# EasyEDA Pro project ProPrj_ProjetElectronique_ESP32Board_2024-12-16.epro, schematic Schematics

## Sheets
1 Power: Board Name: ESP32Board; Create Date: 2024-11-04; Page Name: Power; Project Name: ProjetElectronique_ESP32Board; Schematic Name: Schematics; Update Date: 2024-11-26; Company: EasyEDA.com; Drawn: EasyEDA; Page Size: A4; Part Number: JLCPCB-002; Reviewed: EasyEDA; Version: V0.1
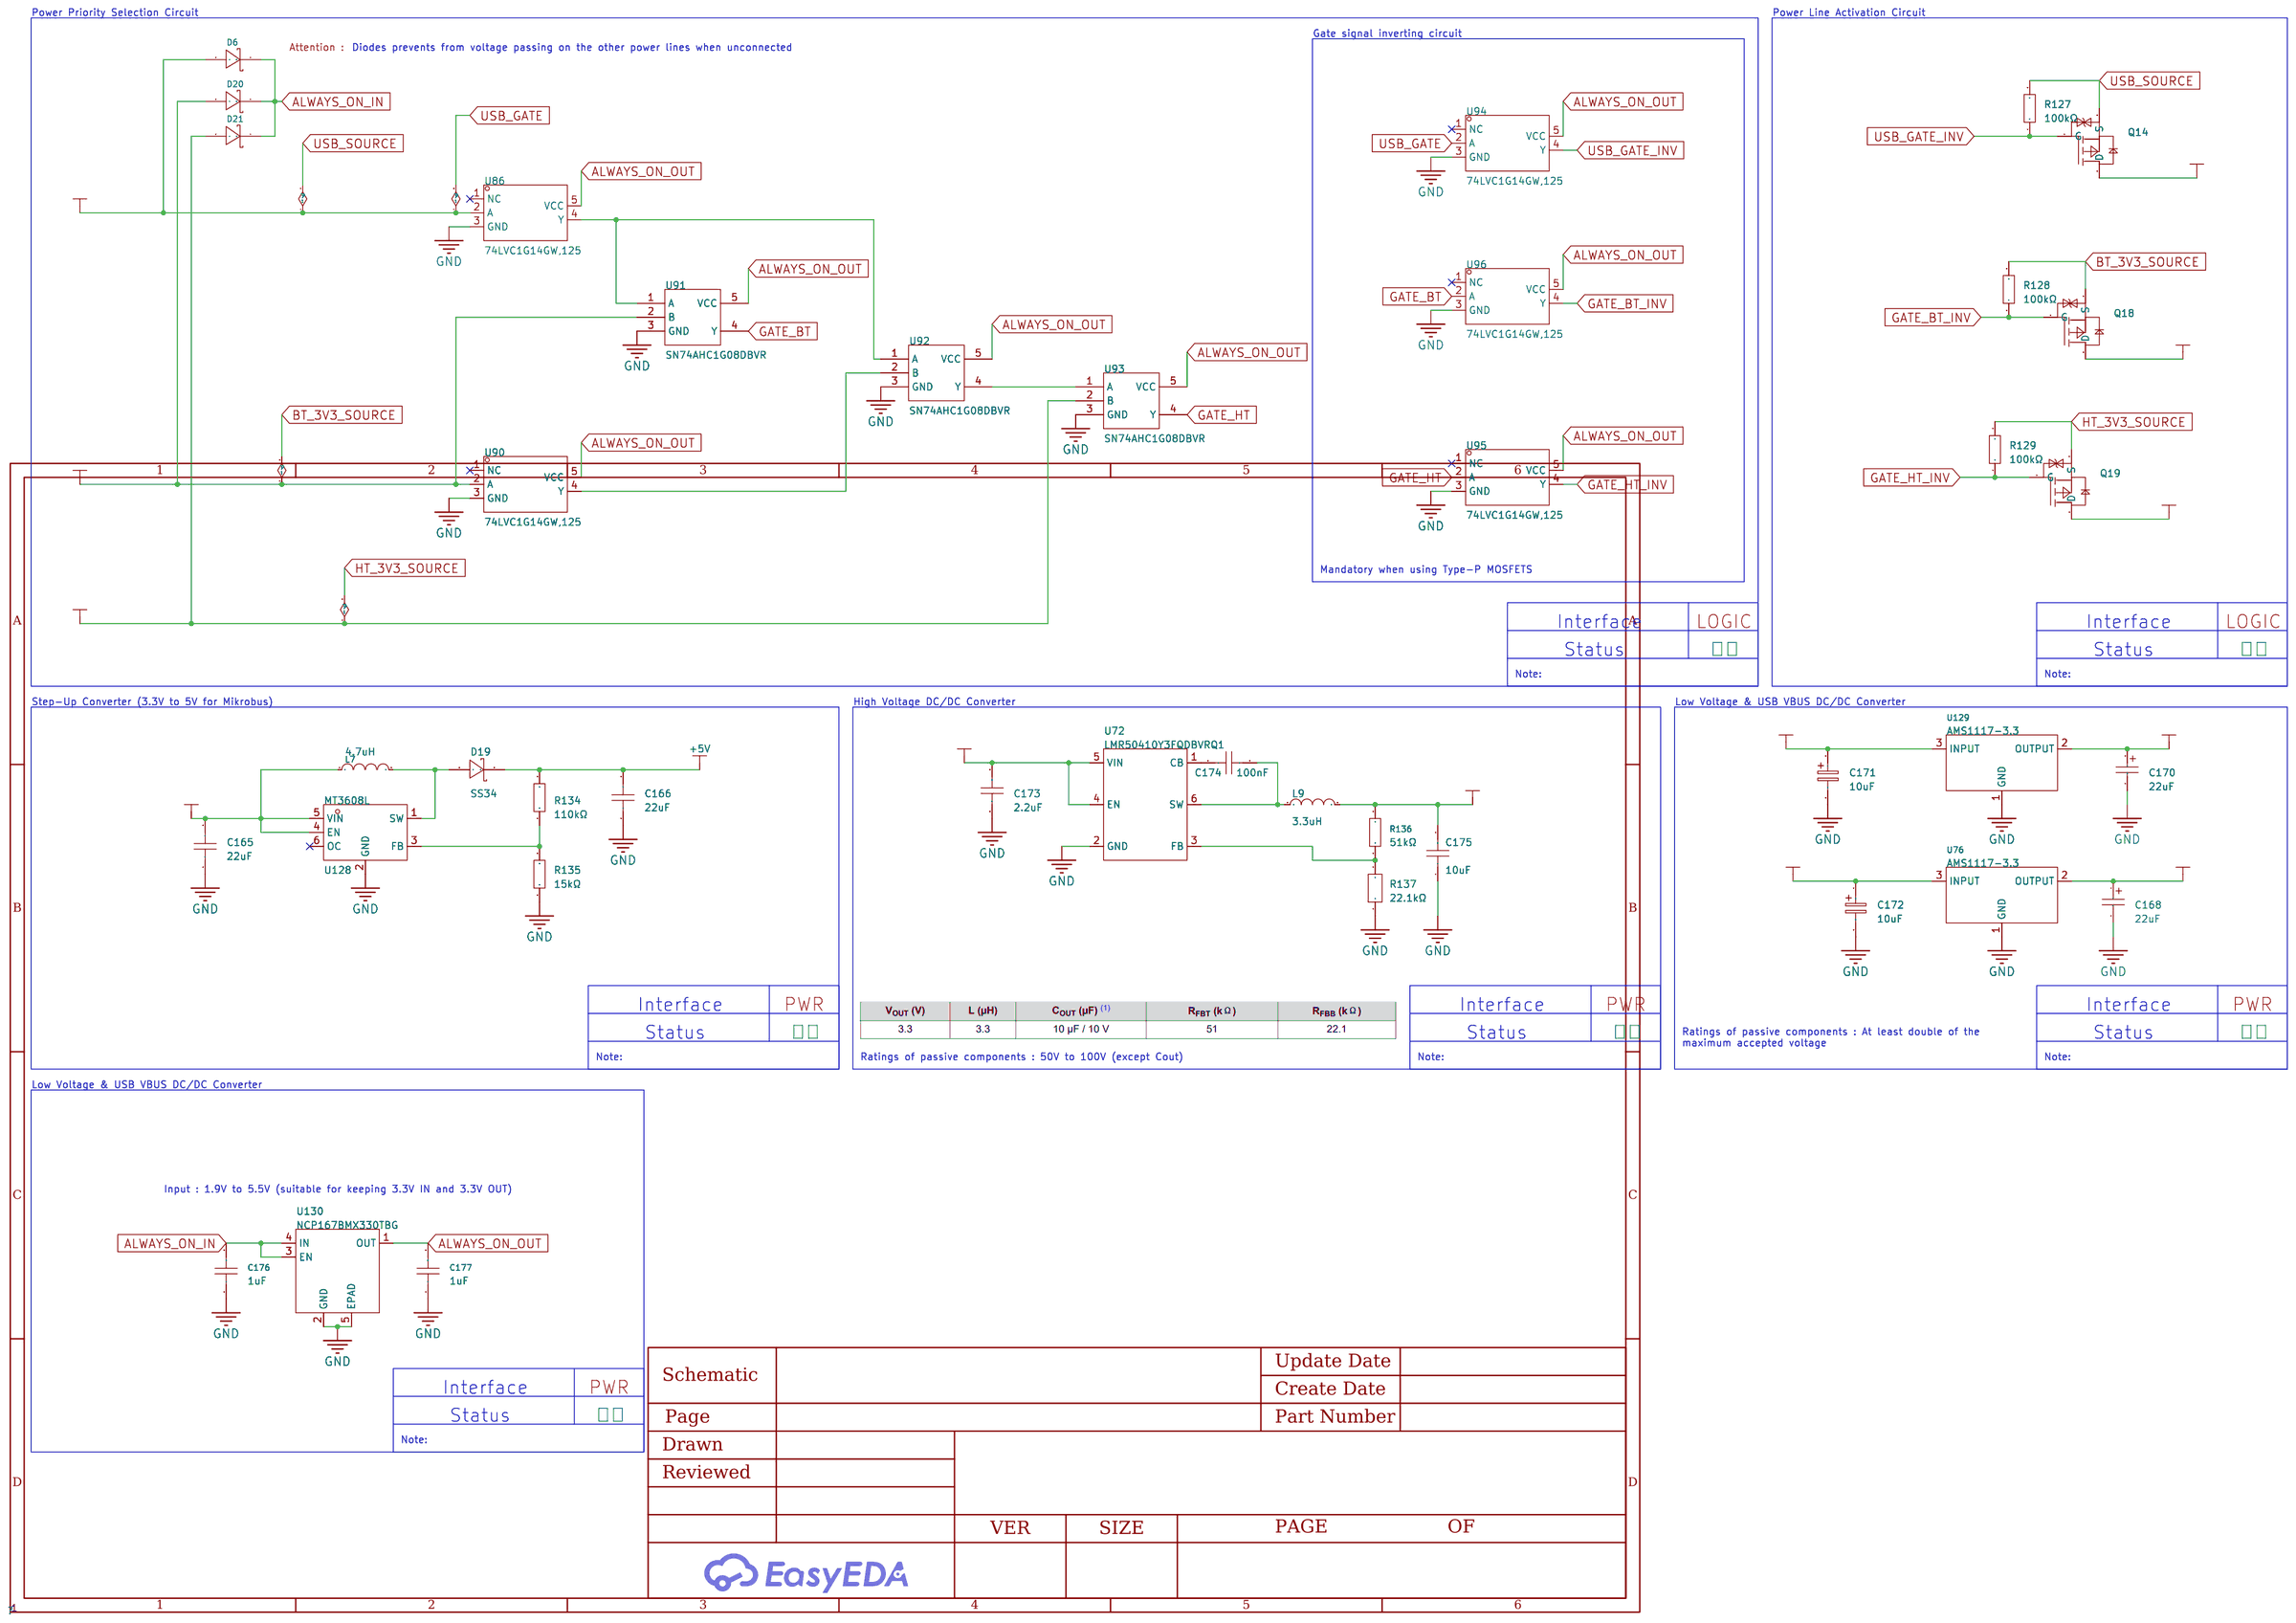
[diagram p0: Power]
2 Microcontroller: Page Name: Microcontroller; Update Date: 2024-12-16
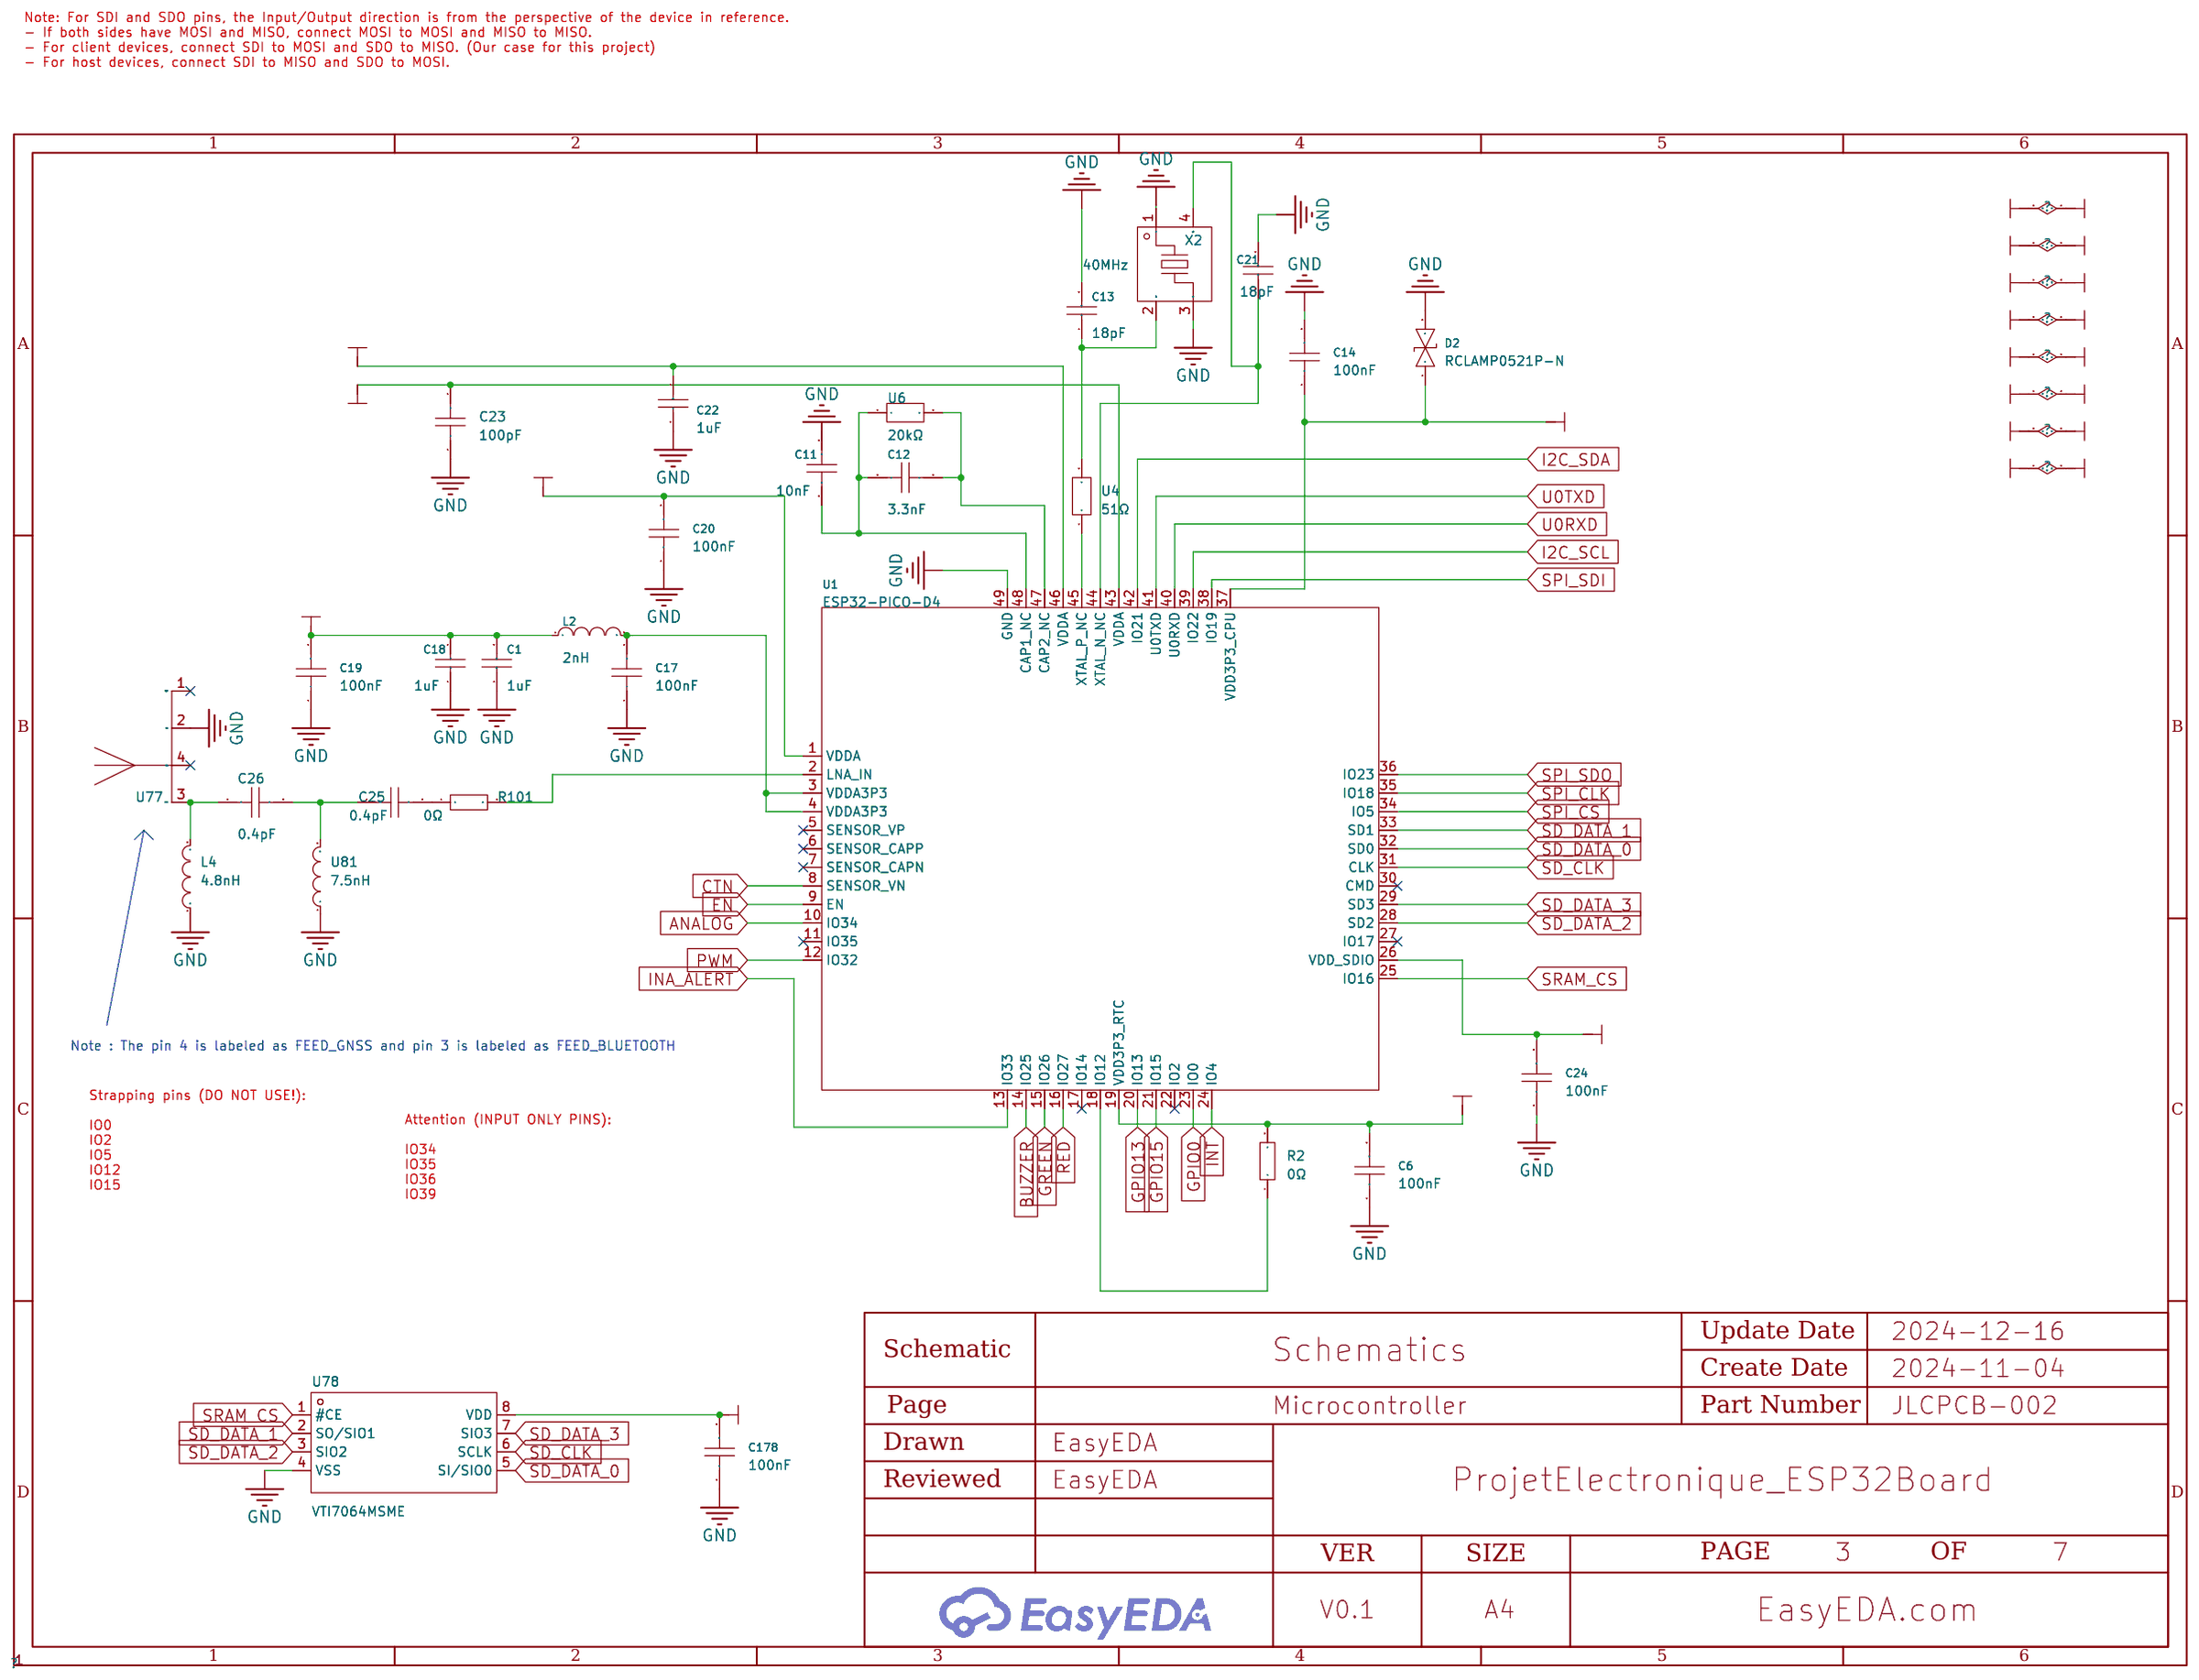
[diagram p1: Microcontroller]
3 Peripherals: Page Name: Peripherals; Update Date: 2024-12-16
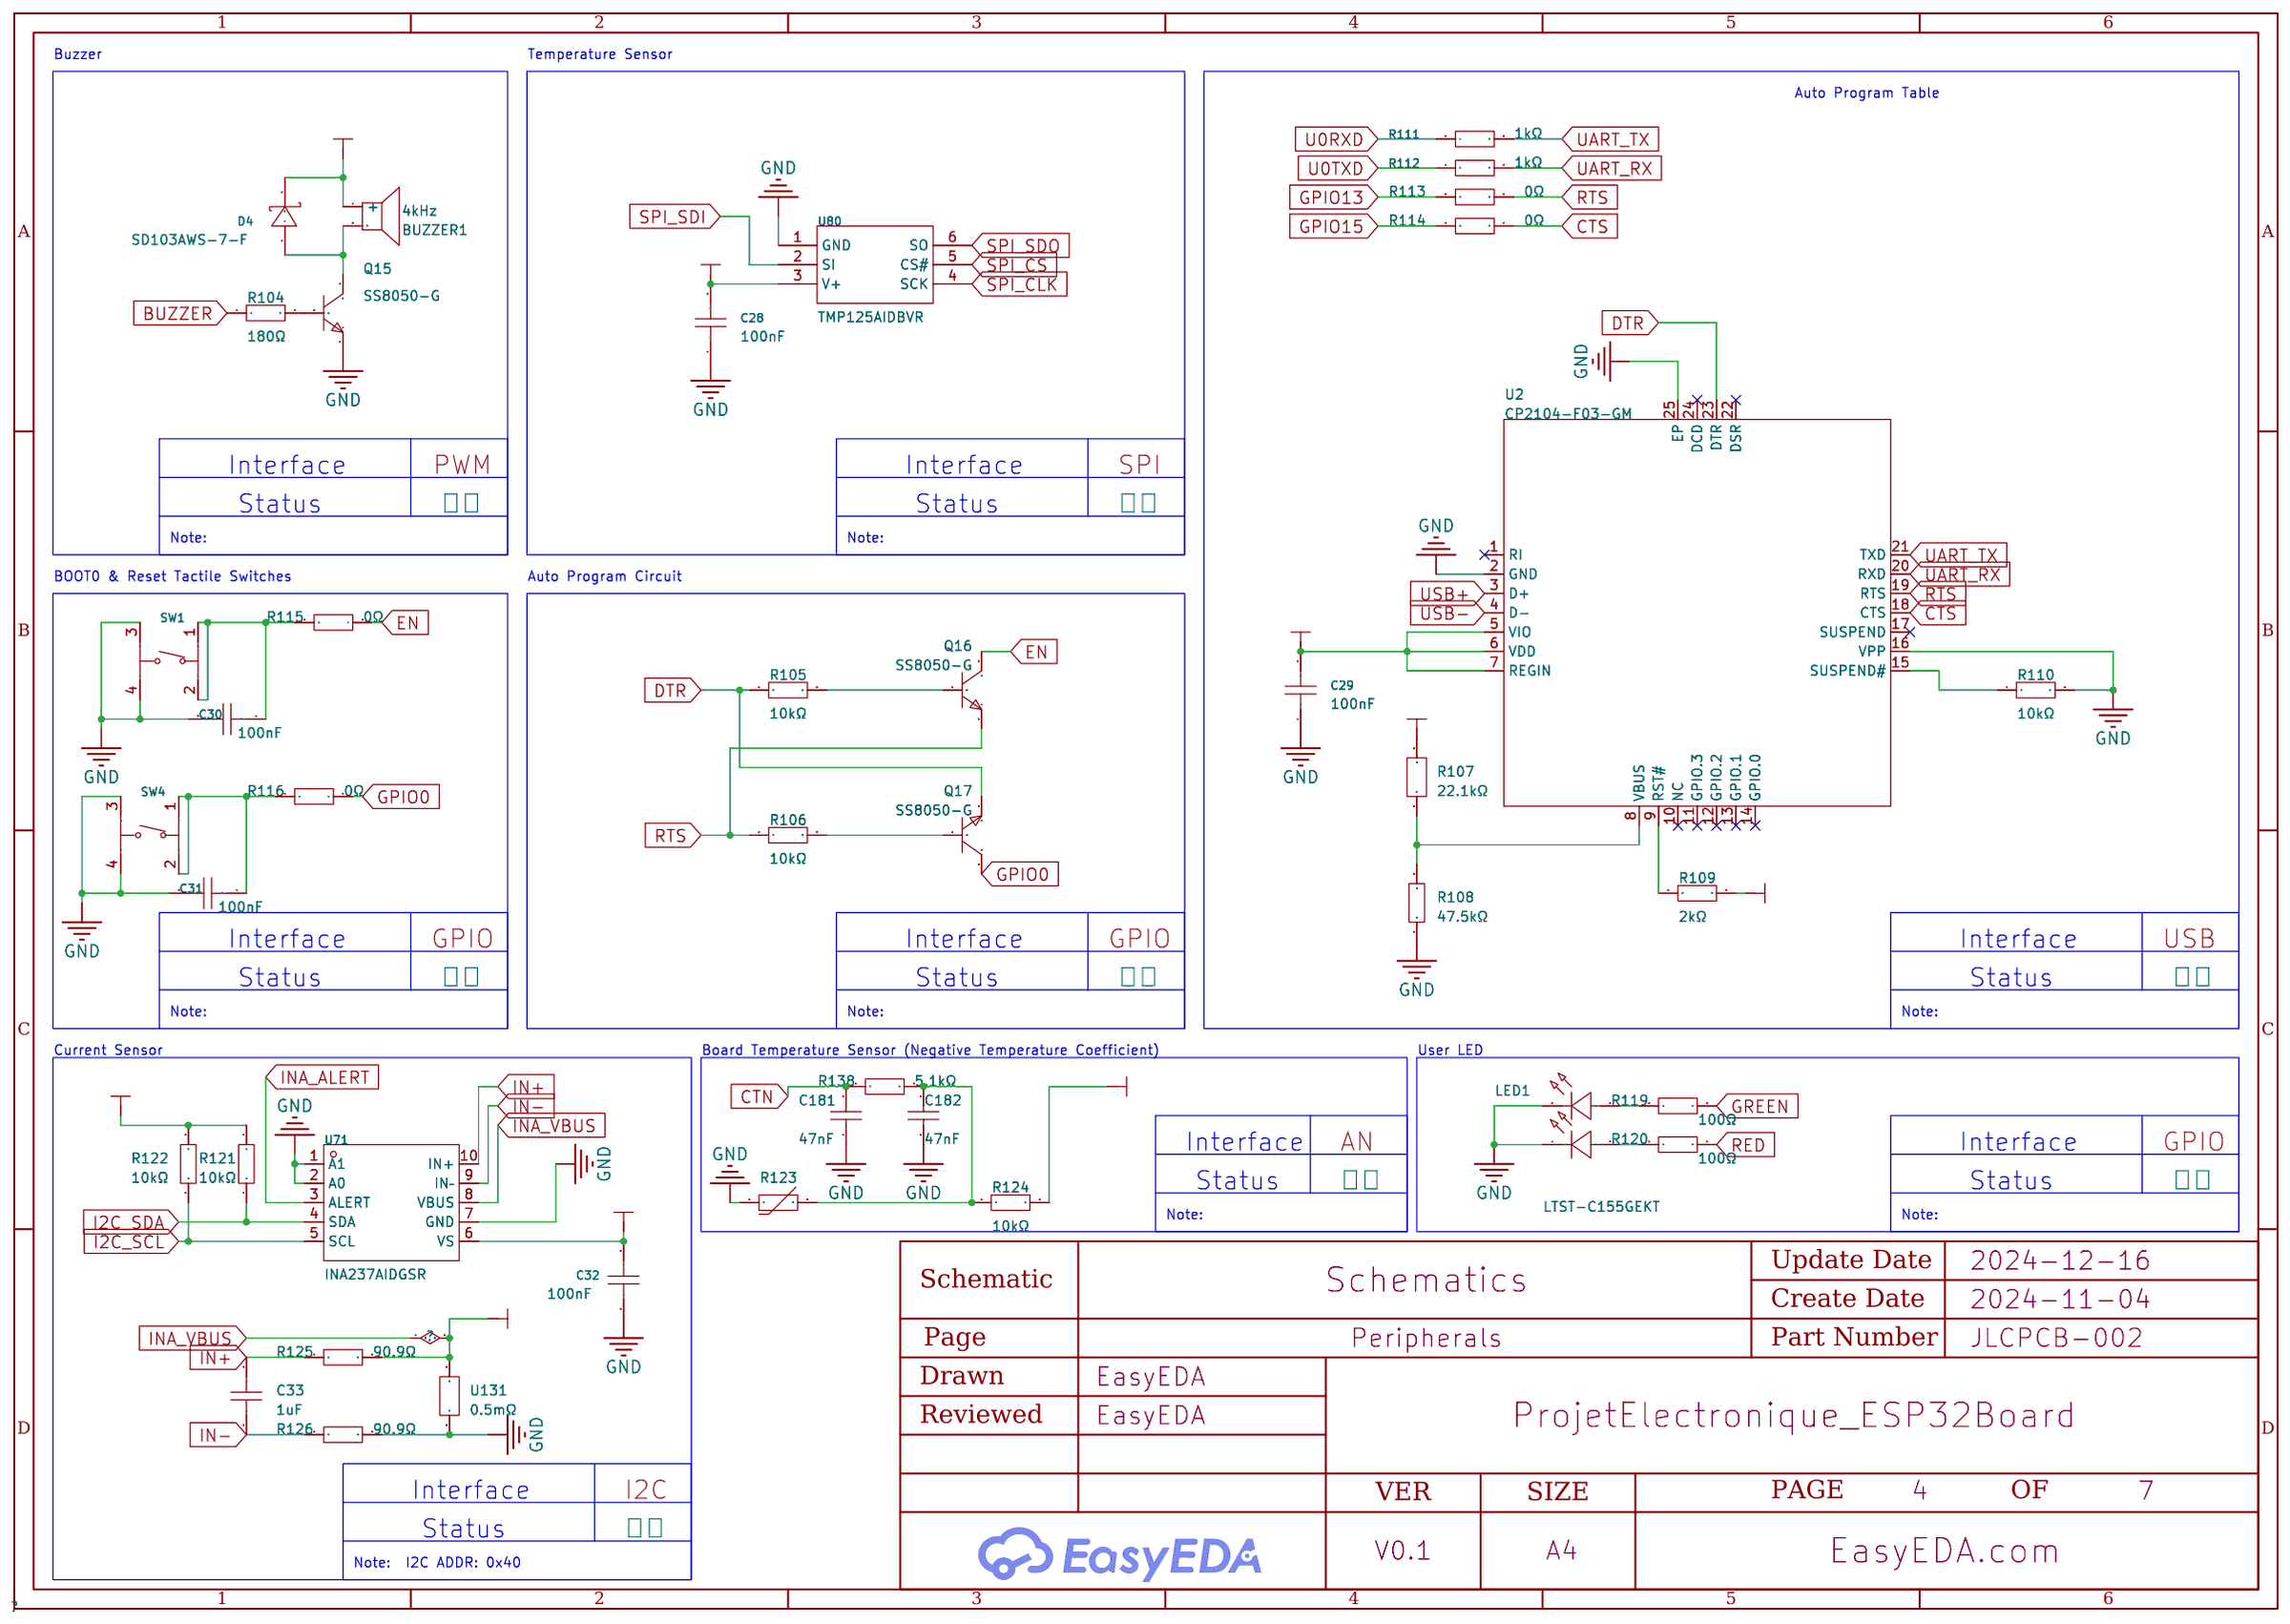
[diagram p2: Peripherals]
4 Index: Page Name: Index; Update Date: 2024-11-04
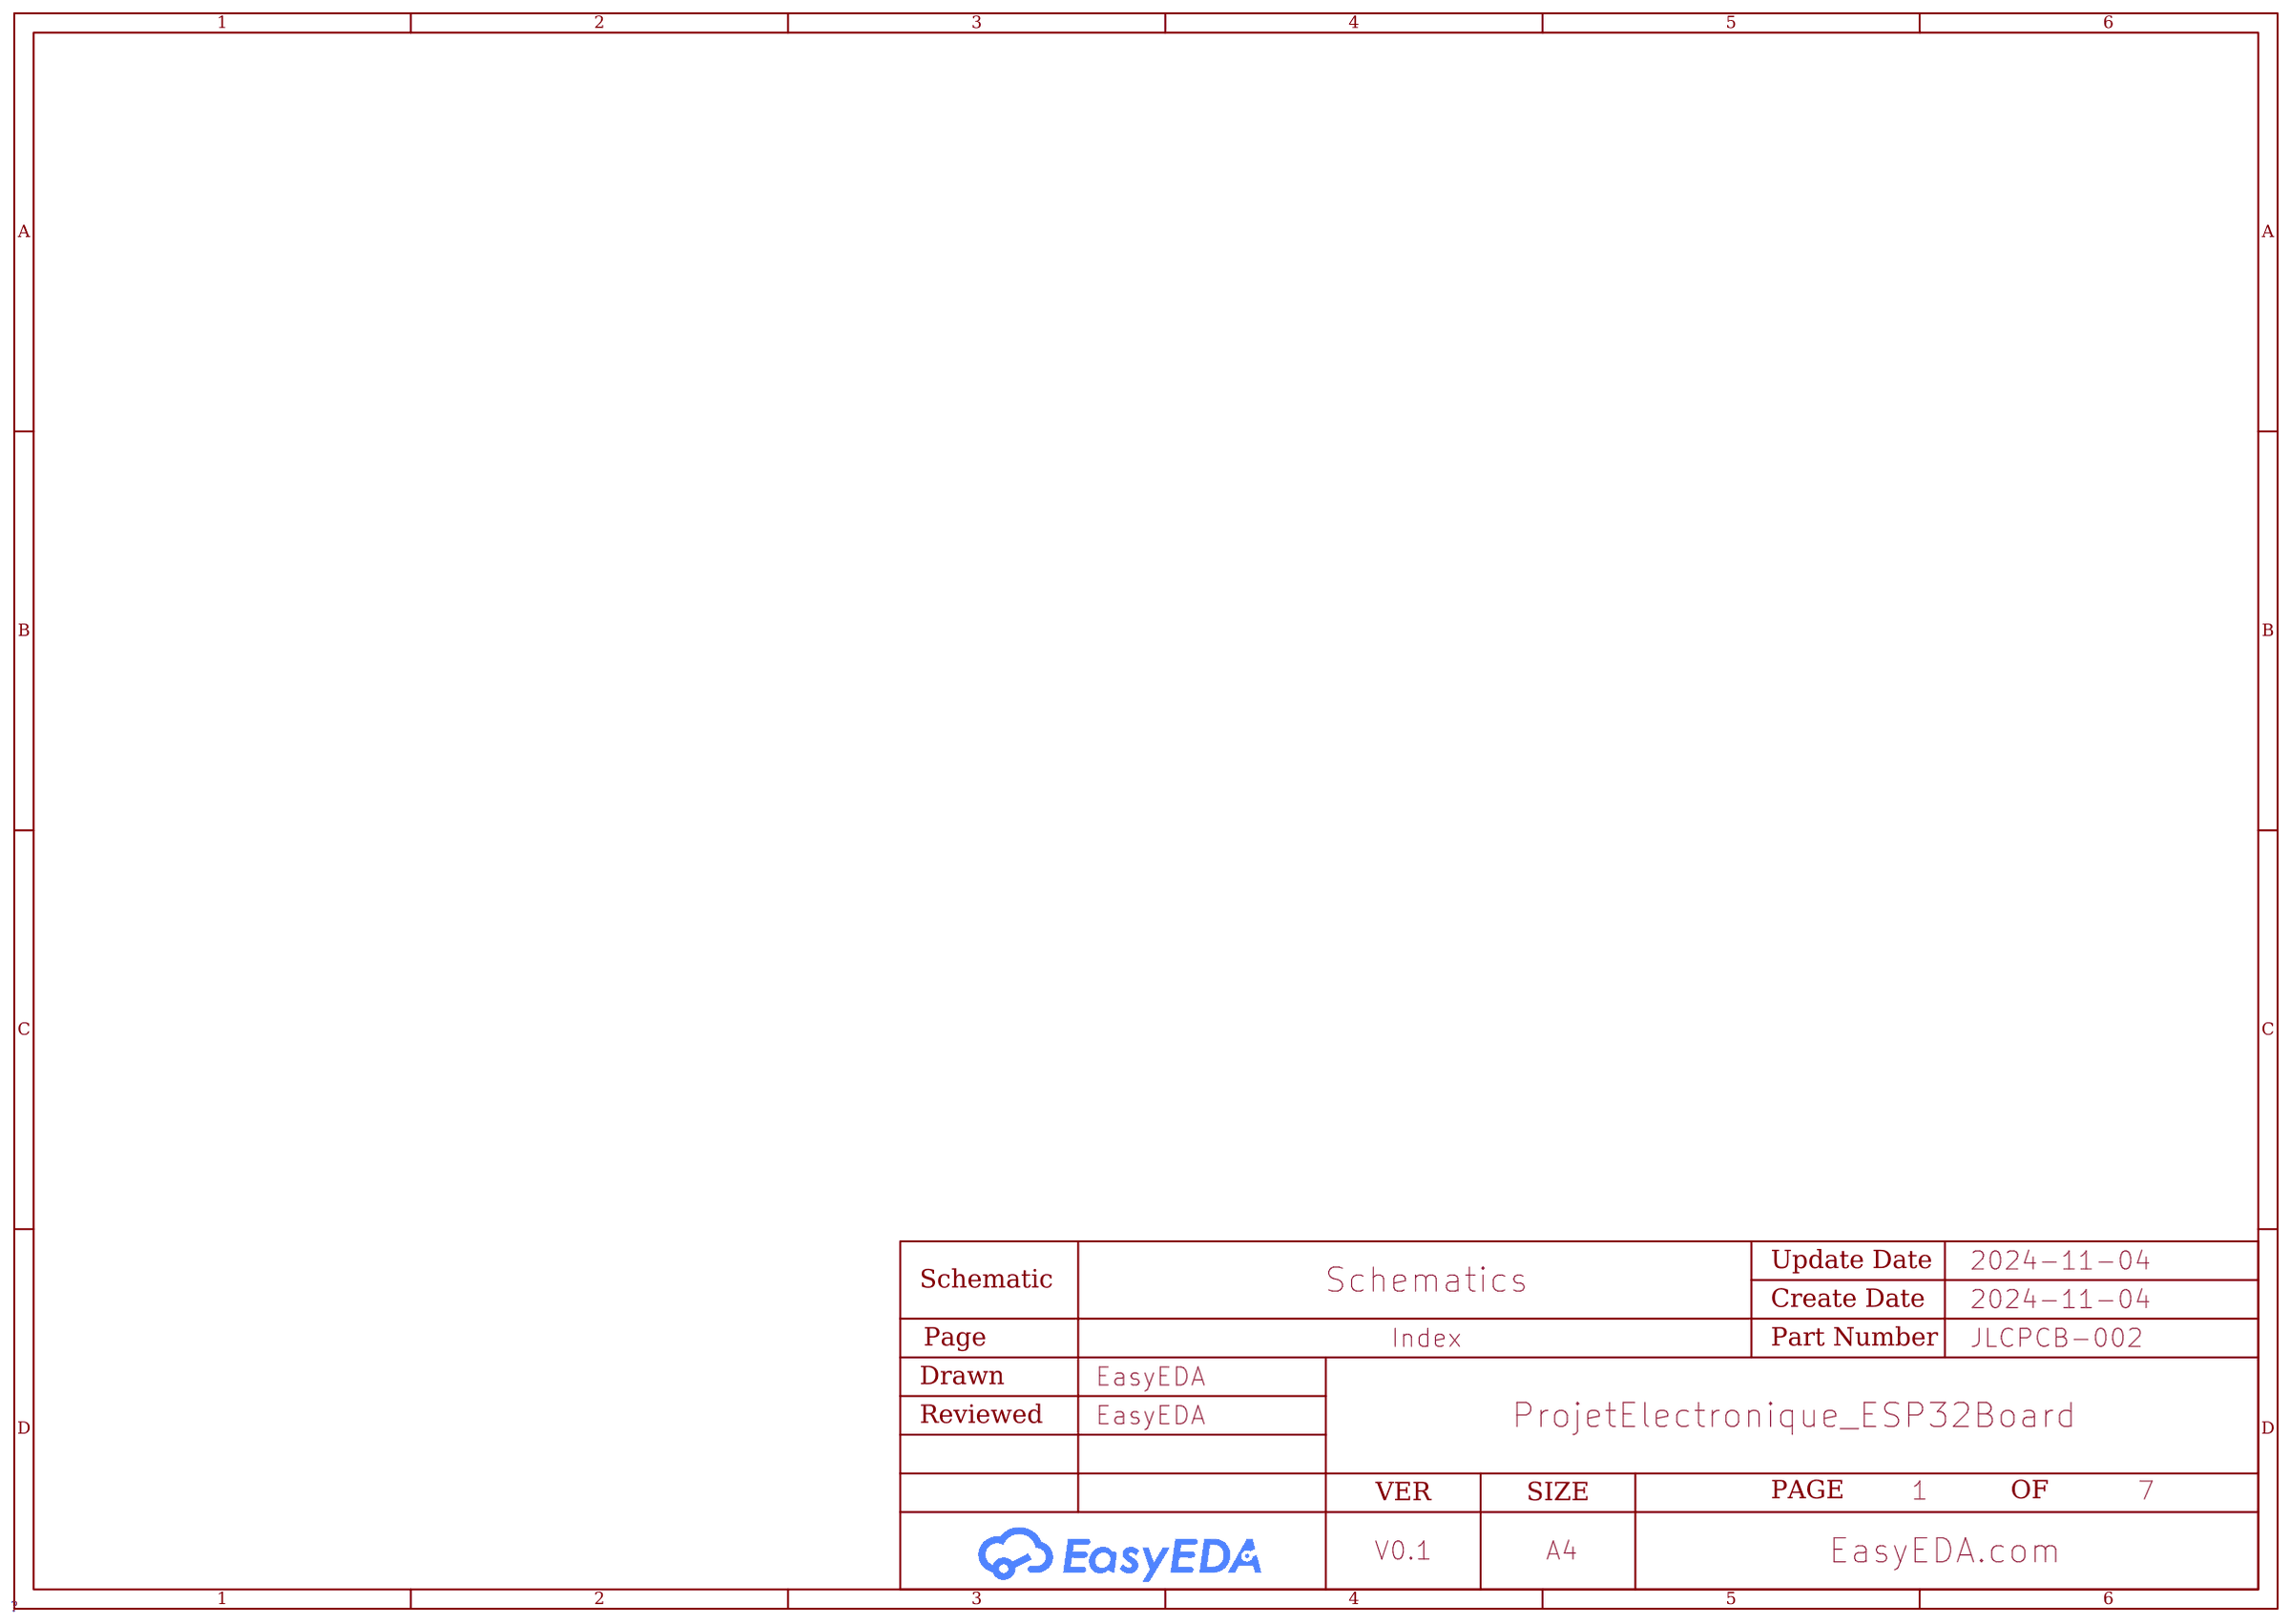
[diagram p3: Index]
5 Connectors: Page Name: Connectors; Update Date: 2024-11-28
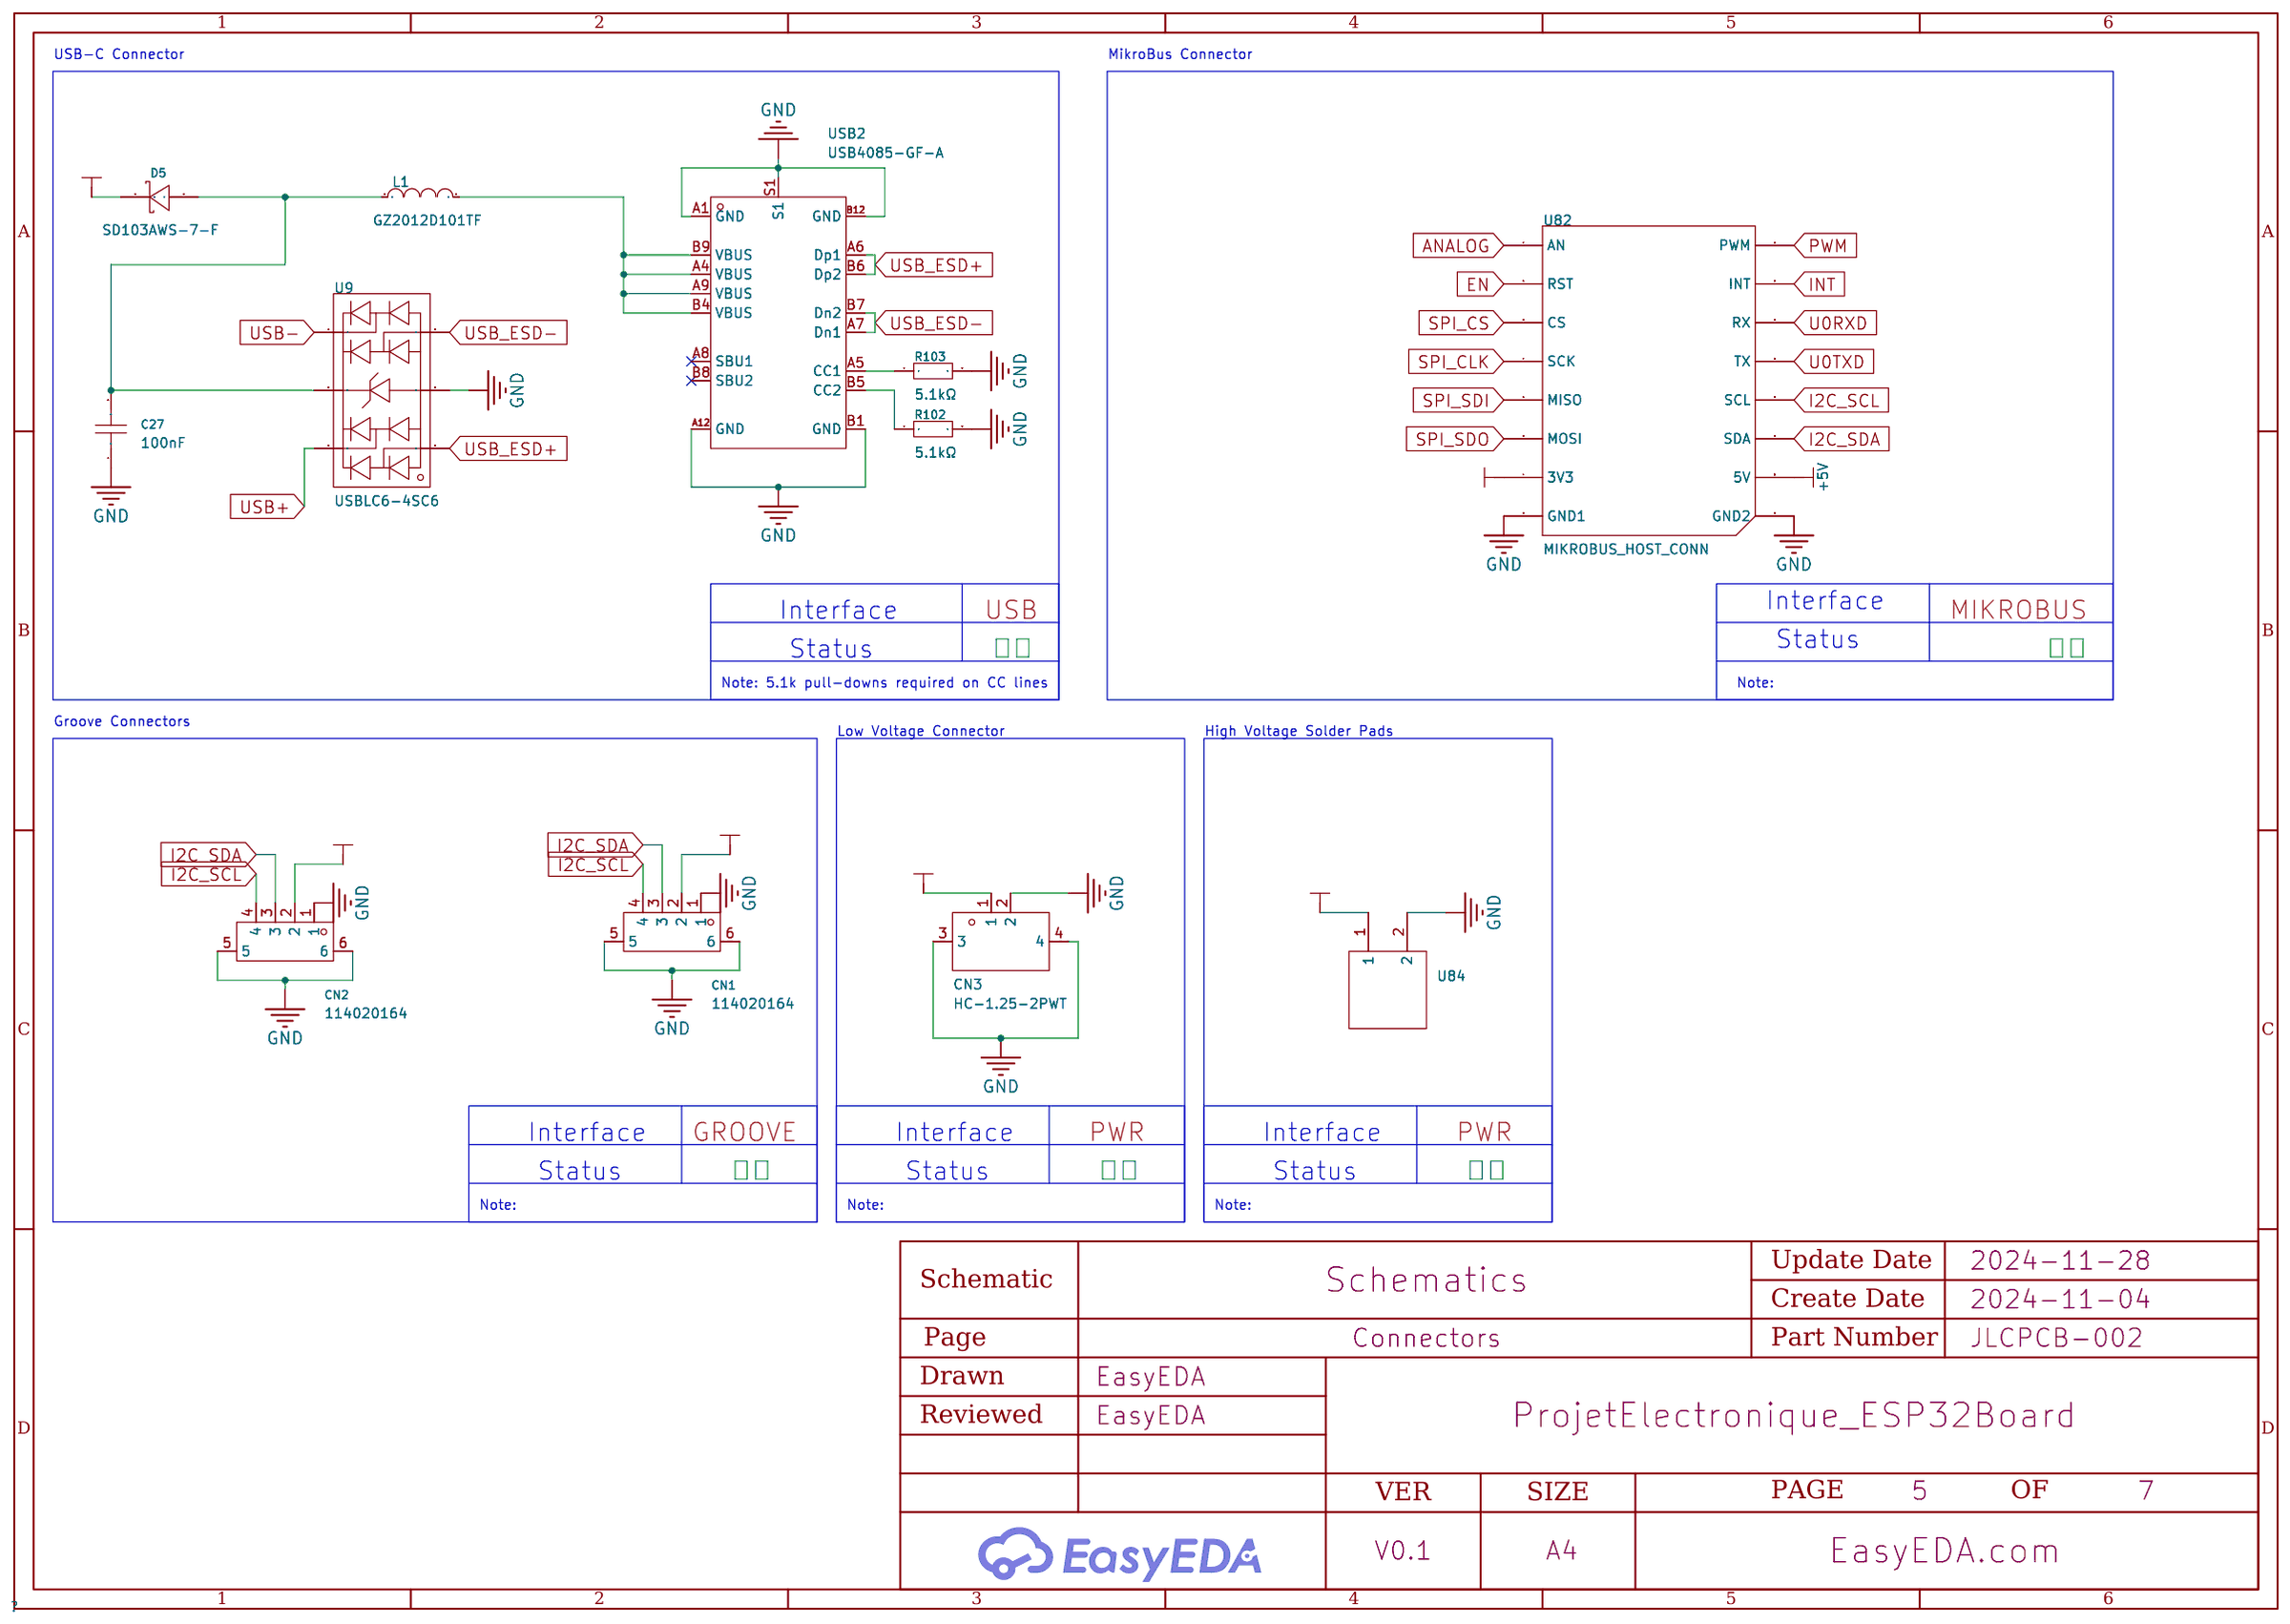
[diagram p4: Connectors]
6 Stackup: Page Name: P1; Project Name: Project Name; Schematic Name: Schematic Name; Update Date: 2021.11.05
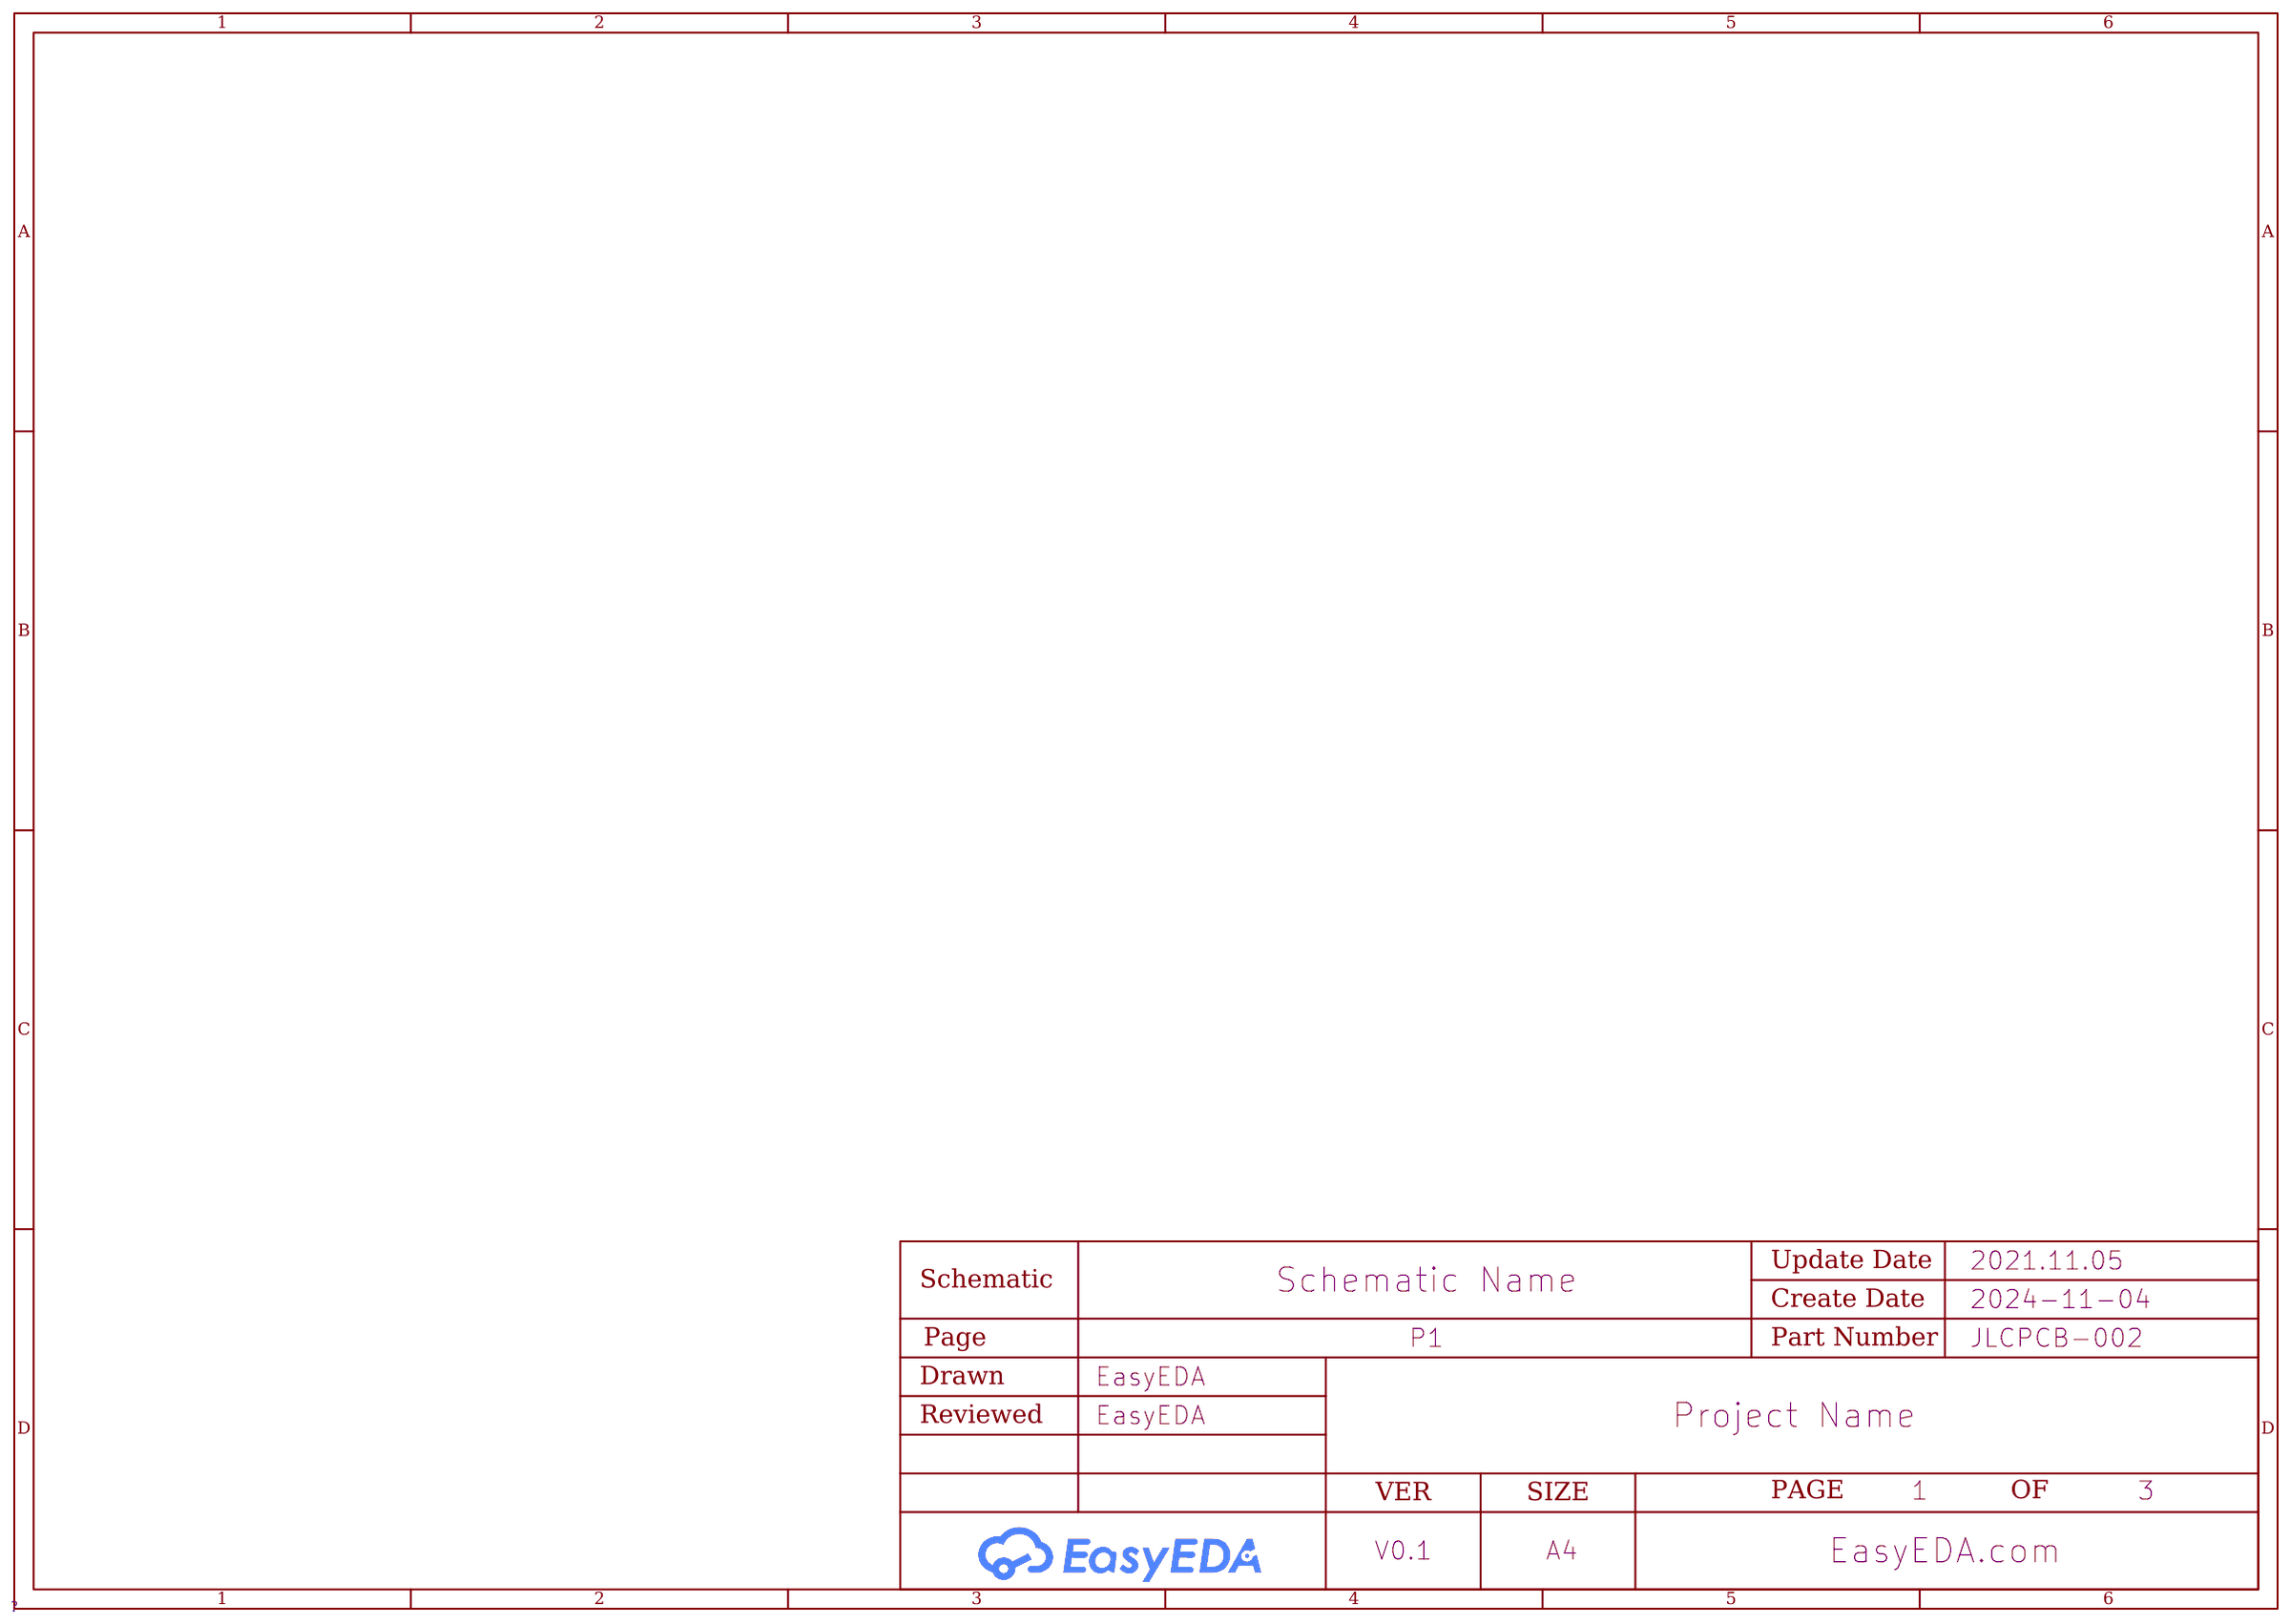
[diagram p5: Stackup]
7 Manufacturing: Page Name: P1; Project Name: Project Name; Schematic Name: Schematic Name; Update Date: 2021.11.05
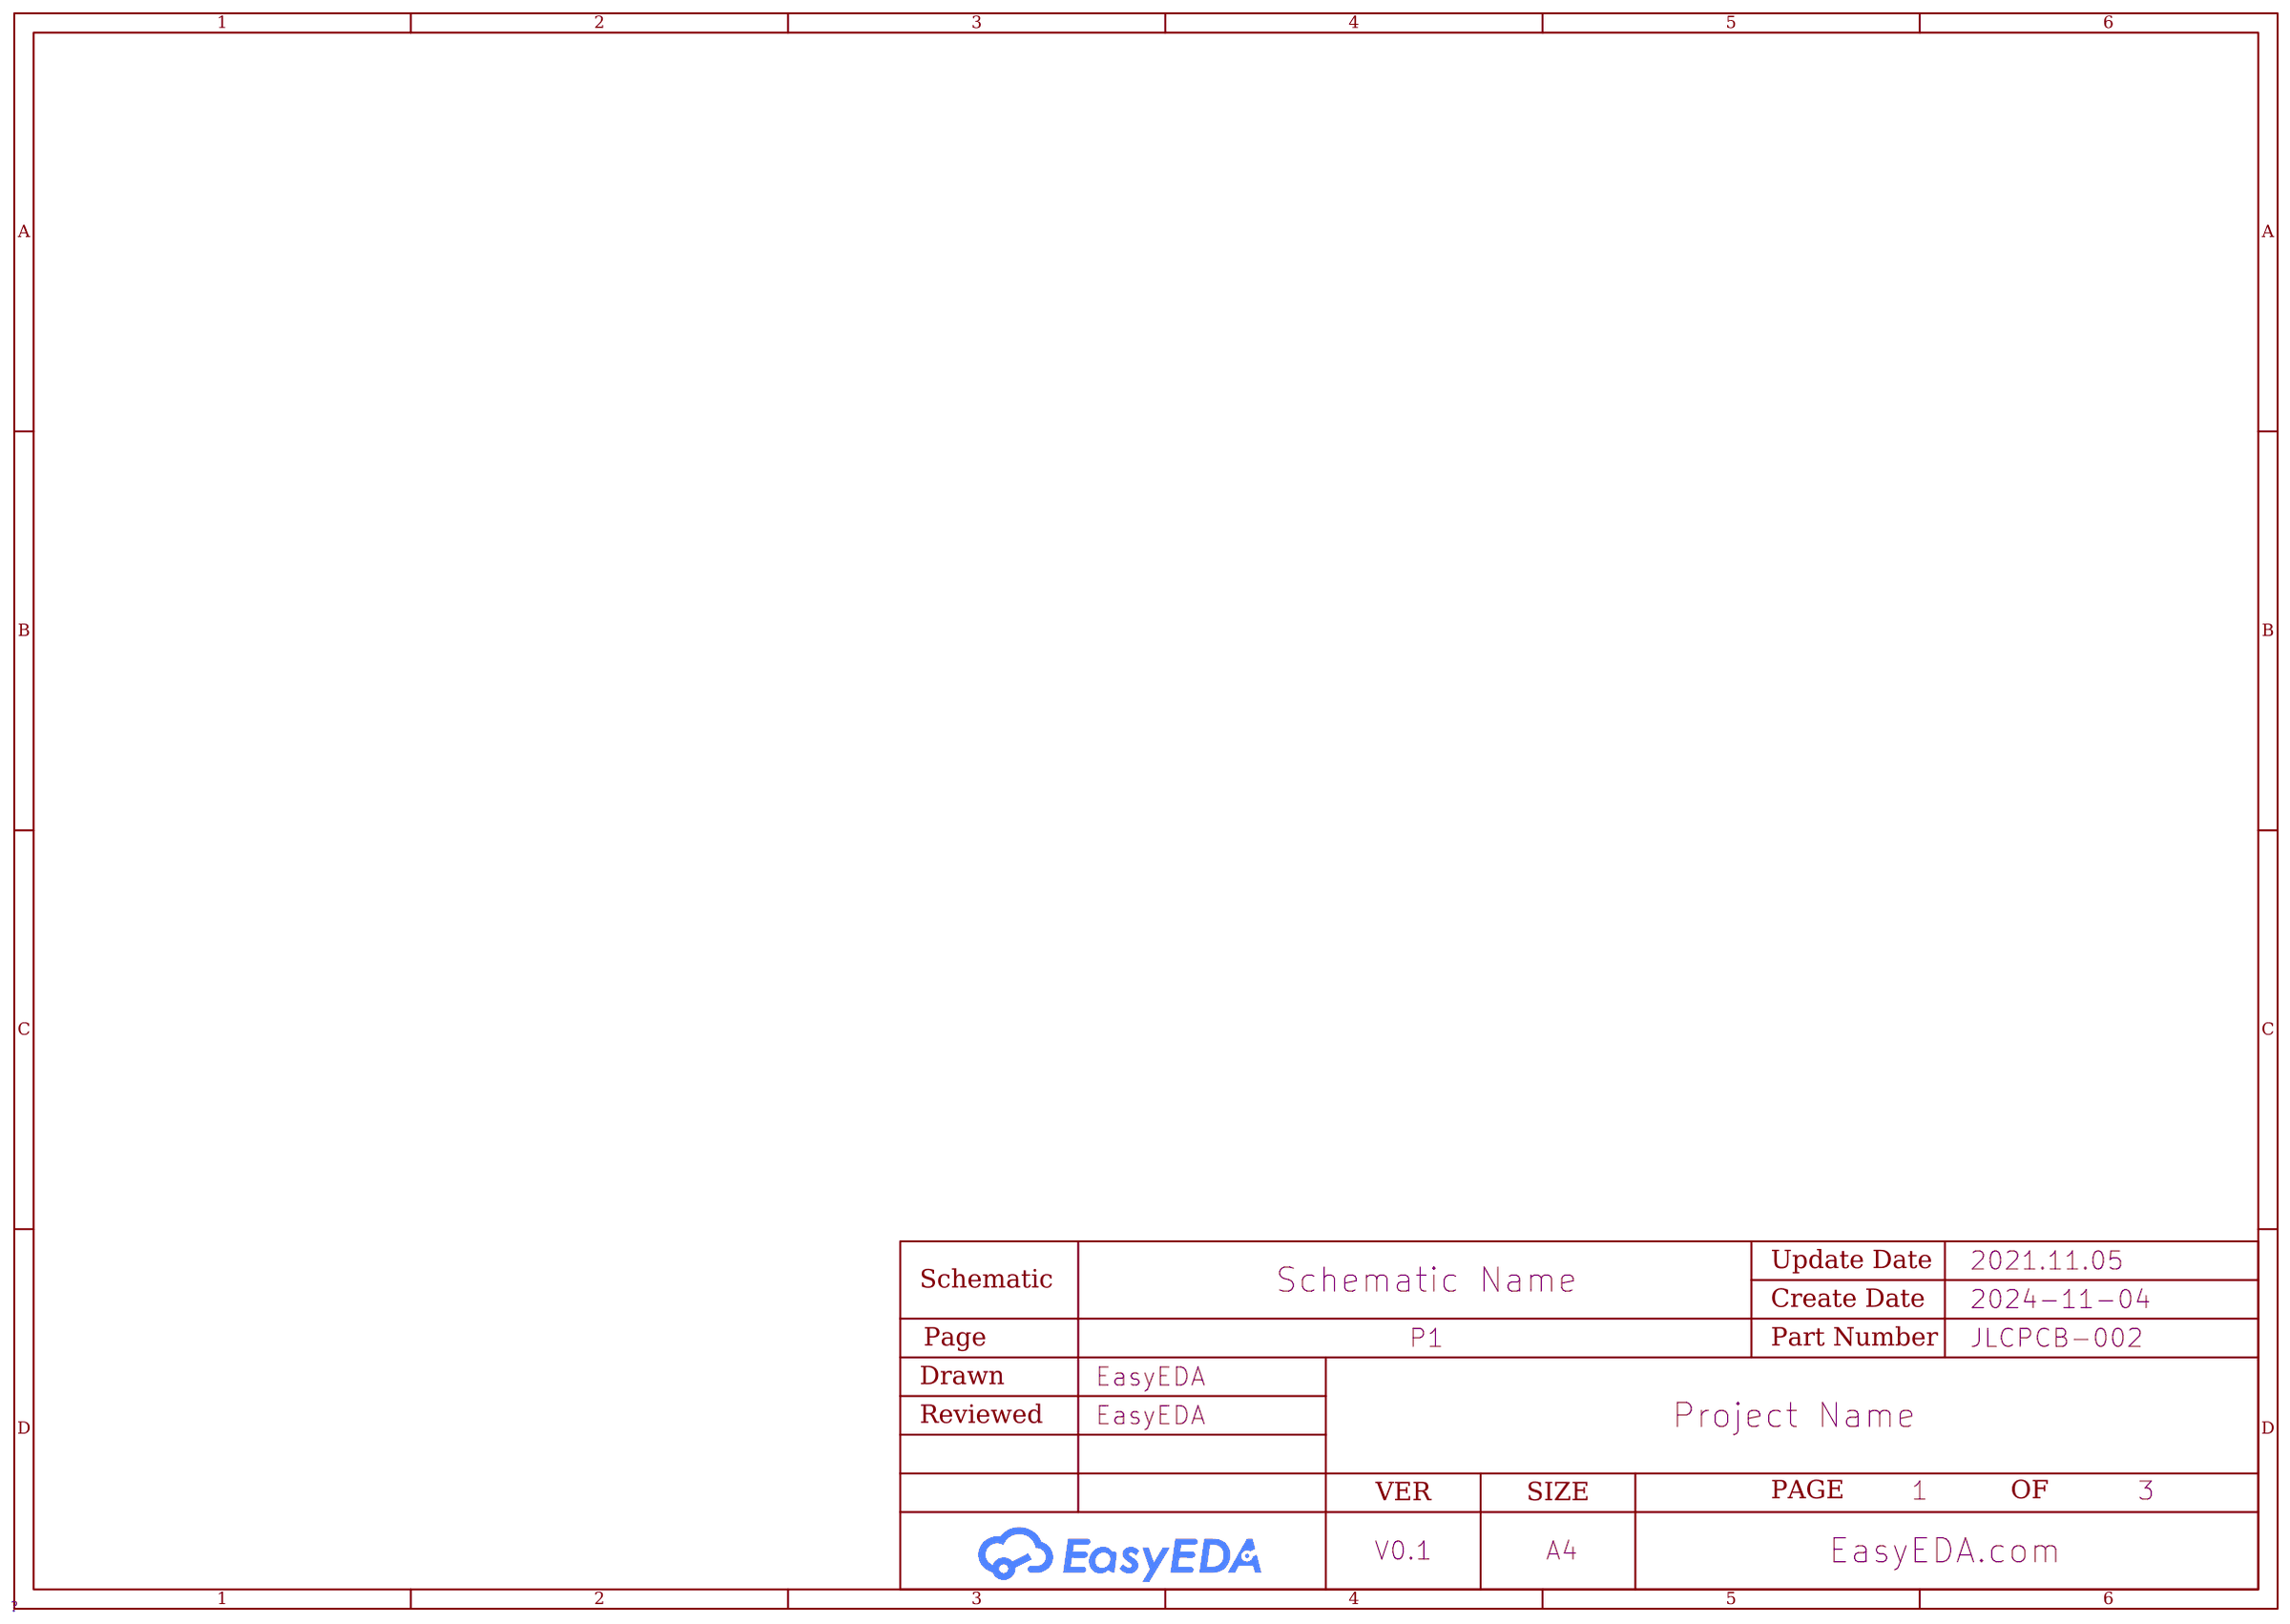
[diagram p6: Manufacturing]

## Parts
sheet Connectors
C27  100nF  [C0402]
CN1  114020164  [CONN-SMD_4P-P2.00_HX20020-4AWB]
CN2  114020164  [CONN-SMD_4P-P2.00_HX20020-4AWB]
CN3  HC-1.25-2PWT  [CONN-SMD_2P-P1.25-HC-1.25-2PWT]
D5  SD103AWS-7-F  [SOD-323_L1.8-W1.3-LS2.5-RD]
L1  GZ2012D101TF  [L0805]
R102  5.1kΩ  [R0402]
R103  5.1kΩ  [R0402]
U9  USBLC6-4SC6  [SOT-23-6_L2.9-W1.6-P0.95-LS2.8-BL]
U82  MIKROBUS_HOST_CONN  [MIKROBUSTOP]
U84  -  [High Voltage Pads]
USB2  USB4085-GF-A  [USC-C-SMD_USB4085-GF-A]
sheet Microcontroller
C1  1uF  [C0402]
C6  100nF  [C0402]
C11  10nF  [C0402]
C12  3.3nF  [C0402]
C13  18pF  [C0402]
C14  100nF  [C0402]
C17  100nF  [C0402]
C18  1uF  [C0402]
C19  100nF  [C0402]  (no BOM)
C20  100nF  [C0402]
C21  18pF  [C0402]
C22  1uF  [C0402]
C23  100pF  [C0402]
C24  100nF  [C0402]
C25  0.4pF  [C0402]
C26  0.4pF  [C0402]
C178  100nF  [C0402]
D2  RCLAMP0521P-N  [X1-DFN1006-2_L1.0-W0.6-P0.65-BI]  (no BOM)
L2  2nH  [IND-SMD_L1.2-W0.6]
L4  4.8nH  [L0402]
R2  0Ω  [R0402]  (no BOM)
R101  0Ω  [R0603]
U1  -  [LGA-48_L7.0-W7.0-P0.50-BL-EP5.4]
U4  51Ω  [R0402]
U6  20kΩ  [R0402]
U77  -  [XCVR_NN03-320]
U78  VTI7064MSME  [SOIC-8_L4.9-W3.9-P1.27-LS6.0-BL]
U81  7.5nH  [L0603]
X2  40MHz  [CRYSTAL-SMD_4P-L3.2-W2.5-BL]
sheet Peripherals
BUZZER1  4kHz  [BUZ-SMD_L4.0-W4.0-P3.50-L]
C28  100nF  [C0402]
C29  100nF  [C0402]
C30  100nF  [C0402]
C31  100nF  [C0402]
C32  100nF  [C0402]
C33  1uF  [C0402]
C181  47nF  [C0402]
C182  47nF  [C0402]
D4  SD103AWS-7-F  [SOD-323_L1.8-W1.3-LS2.5-RD]
LED1  LTST-C155GEKT  [LED-SMD_4P-L3.2-W2.7-TL_LTST-C155GEKT]
Q15  SS8050-G  [SOT-23-3_L2.9-W1.3-P1.90-LS2.4-BR]
Q16  SS8050-G  [SOT-23-3_L2.9-W1.3-P1.90-LS2.4-BR]
Q17  SS8050-G  [SOT-23-3_L2.9-W1.3-P1.90-LS2.4-BR]
R104  180Ω  [R0402]
R105  10kΩ  [R0402]
R106  10kΩ  [R0402]
R107  22.1kΩ  [R0402]
R108  47.5kΩ  [R0402]
R109  2kΩ  [R0402]
R110  10kΩ  [R0402]  (no BOM)
R111  1kΩ  [R0402]
R112  1kΩ  [R0402]
R113  0Ω  [R0402]  (no BOM)
R114  0Ω  [R0402]  (no BOM)
R115  0Ω  [R0402]
R116  0Ω  [R0402]
R119  100Ω  [R0402]
R120  100Ω  [R0402]
R121  10kΩ  [R0402]
R122  10kΩ  [R0402]
R123  SDNT2012X103F3950FTF  [R0805]
R124  10kΩ  [R0402]
R125  90.9Ω  [R0402]
R126  90.9Ω  [R0402]
R138  5.1kΩ  [R0402]
SW1  TS-1187A-B-A-B  [SW-SMD_4P-L5.1-W5.1-P3.70-LS6.5-TL-2]
SW4  TS-1187A-B-A-B  [SW-SMD_4P-L5.1-W5.1-P3.70-LS6.5-TL-2]
U2  CP2104-F03-GM  [VQFN-24_L4.0-W4.0-P0.50-BL-EP2.3]
U71  INA237AIDGSR  [VSSOP-10_L3.0-W3.0-P0.50-LS4.9-BL]
U80  TMP125AIDBVR  [SOT-23-6_L2.9-W1.6-P0.95-LS2.8-BR]
U131  0.5mΩ  [RES-SMD_L6.3-W3.2_R2512]
sheet Power
C165  22uF  [C0402]
C166  22uF  [C0402]
C168  22uF  [CASE-A_3216]
C170  22uF  [CASE-A_3216]
C171  10uF  [CAP-SMD_L3.2-W1.6]
C172  10uF  [CAP-SMD_L3.2-W1.6]
C173  2.2uF  [C1206]
C174  100nF  [C0805]
C175  10uF  [C0402]
C176  1uF  [C0402]
C177  1uF  [C0402]
D6  SD103AWS-7-F  [SOD-323_L1.8-W1.3-LS2.5-RD]
D19  SS34  [SMA_L4.3-W2.6-LS5.2-RD]
D20  SD103AWS-7-F  [SOD-323_L1.8-W1.3-LS2.5-RD]
D21  SD103AWS-7-F  [SOD-323_L1.8-W1.3-LS2.5-RD]
L7  4.7uH  [IND-SMD_L4.8-W4.5]
L9  3.3uH  [IND-SMD_L3.0-W3.0-1]
Q14  PCJ3139K  [SOT-723_L1.2-W0.8-P0.40-LS1.2-BR]
Q18  PCJ3139K  [SOT-723_L1.2-W0.8-P0.40-LS1.2-BR]
Q19  PCJ3139K  [SOT-723_L1.2-W0.8-P0.40-LS1.2-BR]
R127  100kΩ  [R0402]
R128  100kΩ  [R0402]
R129  100kΩ  [R0402]
R134  110kΩ  [R0402]
R135  15kΩ  [R0402]
R136  51kΩ  [R0402]
R137  22.1kΩ  [R0402]
U72  LMR50410Y3FQDBVRQ1  [SOT-23-6_L2.9-W1.6-P0.95-LS2.8-BR]
U76  AMS1117-3.3  [SOT-89-3_L4.5-W2.5-P1.50-LS4.1-BL]
U86  74LVC1G14GW,125  [SOT-353-5_L2.0-W2.1-P0.65-BR]
U90  74LVC1G14GW,125  [SOT-353-5_L2.0-W2.1-P0.65-BR]
U91  SN74AHC1G08DBVR  [SOT-23-5_L3.0-W1.7-P0.95-LS2.8-BR]
U92  SN74AHC1G08DBVR  [SOT-23-5_L3.0-W1.7-P0.95-LS2.8-BR]
U93  SN74AHC1G08DBVR  [SOT-23-5_L3.0-W1.7-P0.95-LS2.8-BR]
U94  74LVC1G14GW,125  [SOT-353-5_L2.0-W2.1-P0.65-BR]
U95  74LVC1G14GW,125  [SOT-353-5_L2.0-W2.1-P0.65-BR]
U96  74LVC1G14GW,125  [SOT-353-5_L2.0-W2.1-P0.65-BR]
U128  MT3608L  [SOT-23-6_L2.9-W1.6-P0.95-LS2.8-BL_3]
U129  AMS1117-3.3  [SOT-89-3_L4.5-W2.5-P1.50-LS4.1-BL]
U130  NCP167BMX330TBG  [XDFN-4_L1.0-W1.0-P0.65-BL-EP]

## Library data of the parts
C6 C14 C17 C19 C20 C24 C27-C32 C178 = CC0402KRX7R5BB104: Capacitance: Tolerance:±10% Tolerance:±10% Voltage Rated: Temperature Coefficient:; LCSC Part Name: 100nF ±10% 6.3V; Supplier Part: C541406; Manufacturer: YAGEO(国巨); Supplier Footprint: 0402; JLCPCB Part Class: Extended Part; Datasheet: https://atta.szlcsc.com/upload/public/pdf/source/20200615/C541406_3B194383538E3D589FF46A58415A779C.pdf; Supplier: LCSC; Tolerance: ±10%
CN1 CN2 = 114020164: Supplier Part: C604849; Manufacturer: Seeed(矽递科技); JLCPCB Part Class: Extended Part; Datasheet: https://atta.szlcsc.com/upload/public/pdf/source/20200611/C604849_A7E0D0E79633222FA47640DE05F81773.pdf; Supplier: LCSC
CN3 = HC-1.25-2PWT: Pins Structure:1x2P Pitch:1.25mm Mounting Style:Horizontal attachment Reference Series:PicoBlade(MX 1.25) Number of Pins:2P Number of Rows:1 Number of PINs Per Row:2 Row Spacing:- Current Rating (Max):1A Contact Material:Brass Contact Plating:Tin Operatin; LCSC Part Name: 1x2P 间距:1.25mm 卧贴 系列:PicoBlade(MX 1.25); Supplier Part: C2845379; Manufacturer: HCTL(华灿天禄); Supplier Footprint: SMD,P=1.25mm,卧贴; JLCPCB Part Class: Extended Part; Datasheet: https://atta.szlcsc.com/upload/public/pdf/source/20240930/9508A8292CCC87B0C29E3A028D56E30A.pdf; Supplier: LCSC; Pins Structure: 1x2P; Pitch: 1.25mm; Mounting Style: Horizontal attachment; Reference Series: PicoBlade(MX 1.25); Number of Pins: 2P; Number of Rows: 1; Number of PINs Per Row: 2; Current Rating (Max): 1A; Contact Material: Brass; Contact Plating: Tin; Operating Temperature Range: -40℃~+105℃; Rated Voltage (Max): 125V; Plastic Material: LCP; Flame Retardant Rating: UL94V-0; Supplementary Features: Auxiliary soldering legs; Z-Height of the Board: 3.57mm; X-Length of Bottom Edge on Board (Spacing Line): 7.55mm; Y-Width of Bottom Edge on Board: 5.25mm
D4-D6 D20 D21 = SD103AWS-7-F: Forward Voltage (Vf@If):600mV@200mA Reverse Voltage (Vr):40V Average Rectified Current (Io):350mA Reverse Leakage Current (Ir):5uA@30V; LCSC Part Name: 电压:40V 电流:350mA; Supplier Part: C154860; Manufacturer: DIODES(美台); Supplier Footprint: SOD-323; JLCPCB Part Class: Extended Part; Datasheet: https://atta.szlcsc.com/upload/public/pdf/source/20180125/C165469_15168650238601302915.pdf; Supplier: LCSC; Forward Voltage (Vf@If): 600mV@200mA; Reverse Voltage (Vr): 40V; Average Rectified Current (Io): 350mA; Reverse Leakage Current (Ir): 5uA@30V
L1 = GZ2012D101TF: Impedance @ Frequency:100Ω@100MHz Tolerance:±25% Tolerance:±25% DC Resistance:- Current Rating:800mA Circuits:1; LCSC Part Name: 单路 0805磁珠 阻抗100Ω@100MHz; Supplier Part: C1015; Manufacturer: Sunlord(顺络); Supplier Footprint: 0805; JLCPCB Part Class: Basic Part; Datasheet: https://atta.szlcsc.com/upload/public/pdf/source/20231030/9B6A3E87682CEC1FF6638DFAA81D73FA.pdf; Supplier: LCSC; Impedance @ Frequency: 100Ω@100MHz; Tolerance: ±25%; Current Rating: 800mA; Circuits: 1
R102 R103 = RTT02512JTH: Type:Thick Film Resistors Resistance: Tolerance:±5% Tolerance:±5% Power(Watts): Overload Voltage (Max): Temperature Coefficient:±100ppm/℃ Temperature Coefficient:±100ppm/℃ Operating Temperature Range:-55℃~+155℃ Operating Temperature Range:-55℃~+155℃; LCSC Part Name: 厚膜电阻 5.1kΩ ±5% 62.5mW; Supplier Part: C103086; Manufacturer: RALEC(旺诠); Supplier Footprint: 0402; JLCPCB Part Class: Extended Part; Datasheet: https://atta.szlcsc.com/upload/public/pdf/source/20191219/C158410_884373A5B7E1BC76BF57BC45A946C093.pdf; Supplier: LCSC; Type: Thick Film Resistors; Tolerance: ±5%; Temperature Coefficient: ±100ppm/℃; Operating Temperature Range: -55℃~+155℃
U9 = USBLC6-4SC6_C5289084: Type:ESD; Supplier Part: C5289084; Manufacturer: Leiditech(雷卯电子); Supplier Footprint: SOT-26; JLCPCB Part Class: Extended Part; Datasheet: https://atta.szlcsc.com/upload/public/pdf/source/20221202/8DFE5009620AC36F7CB6386E5BE77888.pdf; Supplier: LCSC; Type: ESD
U82 = MIKROBUS_HOST_CONN
U84 = High Voltage PAD
USB2 = USB4085-GF-A_1: Supplier Part: C7095263; Manufacturer: GCT; Supplier Footprint: 插件; JLCPCB Part Class: Extended Part; Datasheet: https://atta.szlcsc.com/upload/public/pdf/source/20240130/13BD148244FAEE722A2AF59585DC5F07.pdf; Supplier: LCSC
C1 C18 C22 = CL05A105KO5NNNC: Capacitance: Tolerance:±10% Tolerance:±10% Voltage Rated: Temperature Coefficient:; LCSC Part Name: 1uF ±10% 16V; Supplier Part: C29266; Manufacturer: SAMSUNG(三星); Supplier Footprint: 0402; JLCPCB Part Class: Extended Part; Datasheet: https://atta.szlcsc.com/upload/public/pdf/source/20160218/1457707763339.pdf; Supplier: LCSC; Tolerance: ±10%
C11 = CC0402KRX7R5BB103: Capacitance: Tolerance:±10% Tolerance:±10% Voltage Rated: Temperature Coefficient:; LCSC Part Name: 10nF ±10% 6.3V; Supplier Part: C541370; Manufacturer: YAGEO(国巨); Supplier Footprint: 0402; JLCPCB Part Class: Extended Part; Datasheet: https://atta.szlcsc.com/upload/public/pdf/source/20200615/C541370_B843B3A08EFF7F6723E2927D1FB238F8.pdf; Supplier: LCSC; Tolerance: ±10%
C12 = CC0402KRX7R7BB332: Capacitance: Tolerance:±10% Tolerance:±10% Voltage Rated: Temperature Coefficient:; LCSC Part Name: 3.3nF ±10% 16V; Supplier Part: C541378; Manufacturer: YAGEO(国巨); Supplier Footprint: 0402; JLCPCB Part Class: Extended Part; Datasheet: https://atta.szlcsc.com/upload/public/pdf/source/20200615/C541378_701F0E8B9D5DD111DD9D6A45BA5ABFFD.pdf; Supplier: LCSC; Tolerance: ±10%
C13 C21 = CC0402JRNPO9BN180: Capacitance: Tolerance:±5% Tolerance:±5% Voltage Rated: Temperature Coefficient:; LCSC Part Name: 18pF ±5% 50V; Supplier Part: C106202; Manufacturer: YAGEO(国巨); Supplier Footprint: 0402; JLCPCB Part Class: Extended Part; Datasheet: https://atta.szlcsc.com/upload/public/pdf/source/20170505/1493957838062.pdf; Supplier: LCSC; Tolerance: ±5%
C23 = 0402B101K500NT: Capacitance: Tolerance:±10% Tolerance:±10% Voltage Rated: Temperature Coefficient:; LCSC Part Name: 100pF ±10% 50V; Supplier Part: C2991538; Manufacturer: FH(风华); Supplier Footprint: 0402; JLCPCB Part Class: Extended Part; Datasheet: https://atta.szlcsc.com/upload/public/pdf/source/20200305/C486355_26A10D38EF8C2A5C37091D0039909270.pdf; Supplier: LCSC; Tolerance: ±10%
C25 C26 = GJM1555C1HR40WB01D: Capacitance: Voltage Rated: Temperature Coefficient:; LCSC Part Name: 0.4pF 50V; Supplier Part: C88900; Manufacturer: muRata(村田); Supplier Footprint: 0402; JLCPCB Part Class: Extended Part; Datasheet: https://atta.szlcsc.com/upload/public/pdf/source/20190904/C426118_85E81C7C1F21FC87C5FB6D536E0847B4.pdf; Supplier: LCSC
D2 = RCLAMP0521P-N: Reverse Stand-Off Voltage (Vrwm):5V@Max Maximum Clamping Voltage:16V Peak Pulse Current (Ipp)@10/1000us:3.5A@8/20us Breakdown Voltage:6V Type:TVS; LCSC Part Name: 双向TVS 5V截止 3.5A峰值脉冲; Supplier Part: C316043; Manufacturer: BORN(伯恩半导体); Supplier Footprint: 0402; JLCPCB Part Class: Extended Part; Datasheet: https://atta.szlcsc.com/upload/public/pdf/source/20230417/5CBA4A830C64DEFAAFD05EA421EA0E0A.pdf; Supplier: LCSC; Reverse Stand-Off Voltage (Vrwm): 5V@Max; Maximum Clamping Voltage: 16V; Peak Pulse Current (Ipp)@10/1000us: 3.5A@8/20us; Breakdown Voltage: 6V; Type: TVS
L2 = AISC-0402-2N0J-T: Inductance: Tolerance:±5% Tolerance:±5% Rated Current: Saturation Current (Isat):- DC Resistance (DCR):- Q @ Freq:16@250MHz Frequency - Self Resonant:; LCSC Part Name: 2nH ±5%; Supplier Part: C186816; Manufacturer: ABRACON; Supplier Footprint: SMD,0.6x1.2mm; JLCPCB Part Class: Extended Part; Datasheet: https://atta.szlcsc.com/upload/public/pdf/source/20180802/C186838_CC786A34D20F2D32AF04E86C55008743.pdf; Supplier: LCSC; Tolerance: ±5%; Q @ Freq: 16@250MHz
L4 = LQW15AN4N8G80D: Inductance:4.8nH Tolerance:±2% Tolerance:±2% Rated Current: Saturation Current (Isat):- DC Resistance (DCR): Ratings:-; LCSC Part Name: 4.8nH ±2%; Supplier Part: C412338; Manufacturer: muRata(村田); Supplier Footprint: 0402; JLCPCB Part Class: Extended Part; Datasheet: https://atta.szlcsc.com/upload/public/pdf/source/20200107/C471381_7218EE88923040382E3940C2181C6210.pdf; Supplier: LCSC; Tolerance: ±2%
R2 R113-R116 = RC-02000JT: Type:Thick Film Resistors Resistance: Tolerance:±5% Tolerance:±5% Power(Watts): Overload Voltage (Max): Operating Temperature Range:-55℃~+155℃ Operating Temperature Range:-55℃~+155℃; LCSC Part Name: 厚膜电阻 0Ω ±5% 62.5mW; Supplier Part: C140224; Manufacturer: FH(风华); Supplier Footprint: 0402; JLCPCB Part Class: Extended Part; Datasheet: https://atta.szlcsc.com/upload/public/pdf/source/20140616/1457707091974.pdf; Supplier: LCSC; Type: Thick Film Resistors; Tolerance: ±5%; Operating Temperature Range: -55℃~+155℃
R101 = RS-03000FT: Type:Thick Film Resistors Resistance: Tolerance:±1% Tolerance:±1% Power(Watts): Overload Voltage (Max): Operating Temperature Range:-55℃~+155℃ Operating Temperature Range:-55℃~+155℃; LCSC Part Name: 厚膜电阻 0Ω ±1% 100mW; Supplier Part: C136582; Manufacturer: FH(风华); Supplier Footprint: 0603; JLCPCB Part Class: Extended Part; Datasheet: https://atta.szlcsc.com/upload/public/pdf/source/20140616/1457707091974.pdf; Supplier: LCSC; Type: Thick Film Resistors; Tolerance: ±1%; Operating Temperature Range: -55℃~+155℃
U1 = ESP32-PICO-D4: Frequency Range:2.4GHz~2.5GHz Frequency Range:2.4GHz~2.5GHz Interface:ADC, SDIO, SPI, PWM, UART, I2C, I2S, GPIO Operating Voltage:2.7V~3.6V Operating Voltage:2.7V~3.6V Applications:蓝牙,WiFi Output Power:- Data Rate:- Current Of Transmitting:- Sensitivity:-; Supplier: LCSC; Supplier Part: C193707; Manufacturer: ESPRESSIF(乐鑫); JLCPCB Part Class: Extended Part; LCSC Part Name: 集成2.4GHz WIFI和蓝牙的模组; Supplier Footprint: QFN-48-EP(7x7); Datasheet: https://atta.szlcsc.com/upload/public/pdf/source/20180531/C193707_20E6BADDB6EC95F0C0D505BA515D2866.pdf; Frequency Range: 2.4GHz~2.5GHz; Interface: ADC, SDIO, SPI, PWM, UART, I2C, I2S, GPIO; Operating Voltage: 2.7V~3.6V; Applications: 蓝牙,WiFi; Operating Temperature: -40℃~+85℃
U4 = FRC0402J510 TS: Type:Thick Film Resistors Resistance: Tolerance:±5% Tolerance:±5% Power(Watts): Overload Voltage (Max): Temperature Coefficient:±100ppm/℃ Temperature Coefficient:±100ppm/℃ Operating Temperature Range:-55℃~+155℃ Operating Temperature Range:-55℃~+155℃; LCSC Part Name: 51Ω ±5% 62.5mW 厚膜电阻; Supplier Part: C2906953; Manufacturer: FOJAN(富捷); Supplier Footprint: 0402; JLCPCB Part Class: Extended Part; Datasheet: https://atta.szlcsc.com/upload/public/pdf/source/20211221/925EC7D7225764EE0046F22065062C87.pdf; Supplier: LCSC; Type: Thick Film Resistors; Tolerance: ±5%; Temperature Coefficient: ±100ppm/℃; Operating Temperature Range: -55℃~+155℃
U6 = SCR0402J20K: Type:Thick Film Resistors Resistance: Tolerance:±5% Tolerance:±5% Power(Watts): Overload Voltage (Max): Operating Temperature Range:-55℃~+155℃ Operating Temperature Range:-55℃~+155℃; LCSC Part Name: 厚膜电阻 20kΩ ±5% 62.5mW; Supplier Part: C3017501; Manufacturer: VO(翔胜); Supplier Footprint: 0402; JLCPCB Part Class: Extended Part; Datasheet: https://atta.szlcsc.com/upload/public/pdf/source/20220513/247AF9639BA21CF93567DC289CCC6A22.pdf; Supplier: LCSC; Type: Thick Film Resistors; Tolerance: ±5%; Operating Temperature Range: -55℃~+155℃
U77 = NN03-320
U78 = VTI7064MSME: Memory Size:64Mbit upply Voltage (Vcc):2.7V~3.3V upply Voltage (Vcc):2.7V~3.3V Supply current (Icc):25mA Write Cycle Time (Tw):- Operating Temperature:-25℃~+85℃ Operating Temperature:-25℃~+85℃; Supplier Part: C139966; Manufacturer: Vilsion; Supplier Footprint: SOIC-8; JLCPCB Part Class: Extended Part; Datasheet: https://atta.szlcsc.com/upload/public/pdf/source/20171109/C139966_15102205054531103767.pdf; Supplier: LCSC; Memory Size: 64Mbit; upply Voltage (Vcc): 2.7V~3.3V; Supply current (Icc): 25mA; Operating Temperature: -25℃~+85℃
U81 = LQW18AN7N5C80D: Inductance:7.5nH Rated Current: Saturation Current (Isat):- DC Resistance (DCR):48mΩ Ratings:-; Supplier Part: C3223406; Manufacturer: muRata(村田); Supplier Footprint: 0603; JLCPCB Part Class: Extended Part; Datasheet: https://atta.szlcsc.com/upload/public/pdf/source/20230811/D6F8877DC6860708CBB8CEBBB68D250A.pdf; Supplier: LCSC; DC Resistance (DCR): 48mΩ
X2 = 5YMA40000151SF40E1: Crystal Type:SMD crystal oscillator Frequency: Normal temperature Frequency Tolerance:±10ppm Normal temperature Frequency Tolerance:±10ppm External load capacitor: Frequency Stability(Full temperature range):±10ppm Frequency Stability(Full temperature ran; LCSC Part Name: 40MHz ±10ppm 15pF; Supplier Part: C3003278; Manufacturer: interquip(应达利); Supplier Footprint: SMD3225-4P; JLCPCB Part Class: Extended Part; Datasheet: https://atta.szlcsc.com/upload/public/pdf/source/20221111/983E156BD95B9AFC0E86E6313EA014BF.pdf; Supplier: LCSC; Crystal Type: SMD crystal oscillator; Normal temperature Frequency Tolerance: ±10ppm; Frequency Stability(Full temperature range): ±10ppm; Equivalent Series Resistance (ESR): 40Ω
BUZZER1 = FUET-4020: Oscillator Circuit:无源(外部驱动) Technology Type:电磁式 Operating Voltage:2V~4V Operating Voltage:2V~4V Frequency:4kHz Sound Pressure Level (SPL):65dB@3V,10cm Length:4mm Width:4mm Height:2.5mm; LCSC Part Name: 电压 3V 频率 4KHZ; Supplier Part: C391027; Manufacturer: FUET(福声科技); Supplier Footprint: SMD,4x4mm; JLCPCB Part Class: Extended Part; Datasheet: https://atta.szlcsc.com/upload/public/pdf/source/20191031/C391027_1FC1E5FCD05180B5ABC7B83EB3465454.pdf; Supplier: LCSC; Oscillator Circuit: 无源(外部驱动); Technology Type: 电磁式; Operating Voltage: 2V~4V; Sound Pressure Level (SPL): 65dB@3V,10cm; Length: 4mm; Width: 4mm; Height: 2.5mm
C33 = CC0402KRX5R9BB105: Capacitance: Tolerance:±10% Tolerance:±10% Voltage Rated: Temperature Coefficient:; LCSC Part Name: 1uF ±10% 50V; Supplier Part: C7500380; Manufacturer: YAGEO(国巨); Supplier Footprint: 0402; JLCPCB Part Class: Extended Part; Datasheet: https://atta.szlcsc.com/upload/public/pdf/source/20231121/E6B7358C10879AC104478A67BFFD3D0E.pdf; Supplier: LCSC; Tolerance: ±10%
C181 C182 = 0402B473K500NT: Capacitance:47nF Tolerance:±10% Tolerance:±10% Voltage Rated: Temperature Coefficient:; LCSC Part Name: 47nF ±10% 50V; Supplier Part: C82219; Manufacturer: FH(风华); Supplier Footprint: 0402; JLCPCB Part Class: Extended Part; Datasheet: https://atta.szlcsc.com/upload/public/pdf/source/20200305/C486355_26A10D38EF8C2A5C37091D0039909270.pdf; Supplier: LCSC; Tolerance: ±10%
LED1 = LTST-C155GEKT: Emitted Color:橙红色,Green-yellow Forward Voltage (VF):2V；2.1V Forward Voltage (VF):2V；2.1V Power Dissipation:100mW Forward Current:20mA Dominant Wavelength:621nm；569nm Dominant Wavelength:621nm；569nm Peak Wavelength:565nm；630nm Diode Configuration:- Lens Co; LCSC Part Name: 橙红,普绿/黄绿; Supplier Part: C913080; Manufacturer: LITEON(光宝); Supplier Footprint: 1210; JLCPCB Part Class: Extended Part; Datasheet: https://atta.szlcsc.com/upload/public/pdf/source/20201103/C913080_C62301003616A01BF2F901925CEF64AF.pdf; Supplier: LCSC; Emitted Color: 橙红色,Green-yellow; Forward Voltage (VF): 2V；2.1V; Power Dissipation: 100mW; Forward Current: 20mA; Dominant Wavelength: 621nm；569nm; Peak Wavelength: 565nm；630nm; Lens Color: 无色透明透镜; Luminous Intensity: 7mcd；6mcd; Viewing Angle: 130°; Operating Temperature: -55℃~+85℃
Q15-Q17 = SS8050-G: Transistor Type: Collector Current (Ic): Collector-Emitter Breakdown Voltage (Vceo): Power Dissipation (Pd): DC Current Gain (hFE@Ic,Vce):200@100mA,1V DC Current Gain (hFE@Ic,Vce):200@100mA,1V Transition Frequency (fT):100MHz Collector Cut-Off Current (Ic; LCSC Part Name: SS8050-G(RANGE:200-350) H档(200-350); Supplier Part: C164885; Manufacturer: CJ(江苏长电/长晶); Supplier Footprint: SOT-23; JLCPCB Part Class: Extended Part; Datasheet: https://atta.szlcsc.com/upload/public/pdf/source/20180130/C177739_15172974524031323483.pdf; Supplier: LCSC; DC Current Gain (hFE@Ic,Vce): 200@100mA,1V; Transition Frequency (fT): 100MHz; Collector Cut-Off Current (Icbo): 100nA; Collector-Emitter Saturation Voltage (VCE(sat)@Ic,Ib): 500mV@800mA,80mA
R104 = AC0402FR-07180RL: Type:Thick Film Resistors Resistance: Tolerance:±1% Tolerance:±1% Power(Watts): Overload Voltage (Max): Temperature Coefficient:±100ppm/℃ Temperature Coefficient:±100ppm/℃ Operating Temperature Range:-55℃~+155℃ Operating Temperature Range:-55℃~+155℃; LCSC Part Name: 厚膜电阻 180Ω ±1% 62.5mW; Supplier Part: C226821; Manufacturer: YAGEO(国巨); Supplier Footprint: 0402; JLCPCB Part Class: Extended Part; Datasheet: https://atta.szlcsc.com/upload/public/pdf/source/20180927/C229861_4ABDC471507C1ED6AFB4BA66AFC8620A.pdf; Supplier: LCSC; Type: Thick Film Resistors; Tolerance: ±1%; Temperature Coefficient: ±100ppm/℃; Operating Temperature Range: -55℃~+155℃
R105 R106 R110 R121 R122 R124 = RC0402FR-0710KL: Type:Thick Film Resistors Resistance: Tolerance:±1% Tolerance:±1% Power(Watts): Overload Voltage (Max): Temperature Coefficient:±100ppm/℃ Temperature Coefficient:±100ppm/℃ Operating Temperature Range:-55℃~+155℃ Operating Temperature Range:-55℃~+155℃; LCSC Part Name: 厚膜电阻 10kΩ ±1% 62.5mW; Supplier Part: C60490; Manufacturer: YAGEO(国巨); Supplier Footprint: 0402; JLCPCB Part Class: Extended Part; Datasheet: https://atta.szlcsc.com/upload/public/pdf/source/20170925/C131467_1506321478108990263.pdf; Supplier: LCSC; Type: Thick Film Resistors; Tolerance: ±1%; Temperature Coefficient: ±100ppm/℃; Operating Temperature Range: -55℃~+155℃
R107 R137 = SFR01MZPF2212: Type:Thick Film Resistors Resistance: Tolerance:±1% Tolerance:±1% Power(Watts): Overload Voltage (Max): Temperature Coefficient:±100ppm/℃ Temperature Coefficient:±100ppm/℃ Operating Temperature Range:-55℃~+155℃ Operating Temperature Range:-55℃~+155℃; LCSC Part Name: 厚膜电阻 22.1kΩ ±1% 62.5mW; Supplier Part: C472867; Manufacturer: ROHM(罗姆); Supplier Footprint: 0402; JLCPCB Part Class: Extended Part; Datasheet: https://atta.szlcsc.com/upload/public/pdf/source/20191223/C472880_289A5F8ACBCE764D1749CB409DB44B3B.pdf; Supplier: LCSC; Type: Thick Film Resistors; Tolerance: ±1%; Temperature Coefficient: ±100ppm/℃; Operating Temperature Range: -55℃~+155℃
R108 = AC0402FR-0747K5L: Type:Thick Film Resistors Resistance: Tolerance:±1% Tolerance:±1% Power(Watts): Overload Voltage (Max): Temperature Coefficient:±100ppm/℃ Temperature Coefficient:±100ppm/℃ Operating Temperature Range:-55℃~+155℃ Operating Temperature Range:-55℃~+155℃; LCSC Part Name: 厚膜电阻 47.5kΩ ±1% 62.5mW; Supplier Part: C227098; Manufacturer: YAGEO(国巨); Supplier Footprint: 0402; JLCPCB Part Class: Extended Part; Datasheet: https://atta.szlcsc.com/upload/public/pdf/source/20180927/C229861_4ABDC471507C1ED6AFB4BA66AFC8620A.pdf; Supplier: LCSC; Type: Thick Film Resistors; Tolerance: ±1%; Temperature Coefficient: ±100ppm/℃; Operating Temperature Range: -55℃~+155℃
R109 = AECR0402F2K00K9: Type:Thick Film Resistors Resistance:2kΩ Tolerance:±1% Tolerance:±1% Power(Watts): Overload Voltage (Max): Temperature Coefficient:±100ppm/℃ Temperature Coefficient:±100ppm/℃ Operating Temperature Range:-55℃~+155℃ Operating Temperature Range:-55℃~+155℃; LCSC Part Name: 厚膜电阻 2kΩ ±1% 63mW; Supplier Part: C328313; Manufacturer: RESI(开步睿思); Supplier Footprint: 0402; JLCPCB Part Class: Extended Part; Datasheet: https://atta.szlcsc.com/upload/public/pdf/source/20181212/C352486_55819DC58ECB15BFA3B0F11121E3606D.pdf; Supplier: LCSC; Type: Thick Film Resistors; Tolerance: ±1%; Temperature Coefficient: ±100ppm/℃; Operating Temperature Range: -55℃~+155℃
R111 R112 = RTT02102JTH: Type:Thick Film Resistors Resistance: Tolerance:±5% Tolerance:±5% Power(Watts): Overload Voltage (Max): Temperature Coefficient:±100ppm/℃ Temperature Coefficient:±100ppm/℃ Operating Temperature Range:-55℃~+155℃ Operating Temperature Range:-55℃~+155℃; LCSC Part Name: 厚膜电阻 1kΩ ±5% 62.5mW; Supplier Part: C102758; Manufacturer: RALEC(旺诠); Supplier Footprint: 0402; JLCPCB Part Class: Extended Part; Datasheet: https://atta.szlcsc.com/upload/public/pdf/source/20191219/C158410_884373A5B7E1BC76BF57BC45A946C093.pdf; Supplier: LCSC; Type: Thick Film Resistors; Tolerance: ±5%; Temperature Coefficient: ±100ppm/℃; Operating Temperature Range: -55℃~+155℃
R119 R120 = CR-02JL6--100R: Type:Thick Film Resistors Resistance: Tolerance:±5% Tolerance:±5% Power(Watts): Overload Voltage (Max): Operating Temperature Range:-55℃~+155℃ Operating Temperature Range:-55℃~+155℃; LCSC Part Name: 厚膜电阻 100Ω ±5% 62.5mW; Supplier Part: C279985; Manufacturer: Viking(光颉); Supplier Footprint: 0402; JLCPCB Part Class: Extended Part; Datasheet: https://atta.szlcsc.com/upload/public/pdf/source/20191209/C468528_6D47111E78448DF1E24F001397B2DC7E.pdf; Supplier: LCSC; Type: Thick Film Resistors; Tolerance: ±5%; Operating Temperature Range: -55℃~+155℃
R123 = SDNT2012X103F3950FTF: Resistance @ 25℃: B Constant (25℃/50℃): Resistance Tolerance: B Constant (25℃/75℃):- B Constant (25℃/85℃):- B Constant (25℃/100℃):- Power: B Constant Tolerance: Steady State Current (Max):440uA Operating Temperature:-55℃~+125℃ Operating Temperature:-55℃~+; LCSC Part Name: 10kΩ 电阻精度:±1% 3950K; Supplier Part: C95968; Manufacturer: Sunlord(顺络); Supplier Footprint: 0805; JLCPCB Part Class: Extended Part; Datasheet: https://atta.szlcsc.com/upload/public/pdf/source/20210916/BF106A3565EDFEB141CB3E0EA3A661F8.pdf; Supplier: LCSC; Steady State Current (Max): 440uA; Operating Temperature: -55℃~+125℃
R125 R126 = RC-02W90R9FT: Type:Thick Film Resistors Resistance: Tolerance:±1% Tolerance:±1% Power(Watts): Overload Voltage (Max): Temperature Coefficient:±200ppm/℃ Temperature Coefficient:±200ppm/℃ Operating Temperature Range:-55℃~+155℃ Operating Temperature Range:-55℃~+155℃; LCSC Part Name: 厚膜电阻 90.9Ω ±1% 62.5mW; Supplier Part: C321646; Manufacturer: FH(风华); Supplier Footprint: 0402; JLCPCB Part Class: Extended Part; Datasheet: https://atta.szlcsc.com/upload/public/pdf/source/20140616/1457707091974.pdf; Supplier: LCSC; Type: Thick Film Resistors; Tolerance: ±1%; Temperature Coefficient: ±200ppm/℃; Operating Temperature Range: -55℃~+155℃
R138 = RK73H1ETTP5101F: Type:Thick Film Resistors Resistance: Tolerance:±1% Tolerance:±1% Power(Watts): Overload Voltage (Max): Temperature Coefficient:±100ppm/℃ Temperature Coefficient:±100ppm/℃ Operating Temperature Range:-55℃~+155℃ Operating Temperature Range:-55℃~+155℃; LCSC Part Name: 厚膜电阻 5.1kΩ ±1% 100mW; Supplier Part: C159990; Manufacturer: KOA; Supplier Footprint: 0402; JLCPCB Part Class: Extended Part; Datasheet: https://atta.szlcsc.com/upload/public/pdf/source/20190516/C346145_73DC9C40D36D5A63BE57BD2EFB7F1781.pdf; Supplier: LCSC; Type: Thick Film Resistors; Tolerance: ±1%; Temperature Coefficient: ±100ppm/℃; Operating Temperature Range: -55℃~+155℃
SW1 SW4 = TS-1187A-B-A-B: Circuit:SPST Actuator Style:Round Button Operating Force:160gf Mounting Style:Brick nogging Switch Length:5.1mm Switch Width:5.1mm Switch Height:1.5mm Strike Gundam:不带 Contact Current:50mA Voltage Rating (DC):12V Insulation Resistance:- Actuator/Cap Color; LCSC Part Name: 5.1*5.1*1.5mm 立贴 轻触开关; Supplier Part: C318884; Manufacturer: XKB Connectivity(中国星坤); Supplier Footprint: SMD; JLCPCB Part Class: Basic Part; Datasheet: https://atta.szlcsc.com/upload/public/pdf/source/20200227/C318890_053E50208A88A7BA1965D8746000774E.pdf; Supplier: LCSC; Circuit: SPST; Actuator Style: Round Button; Operating Force: 160gf; Mounting Style: Brick nogging; Switch Length: 5.1mm; Switch Width: 5.1mm; Switch Height: 1.5mm; Strike Gundam: 不带; Contact Current: 50mA; Voltage Rating (DC): 12V; Actuator/Cap Color: 金色; With Lamp: No; Mechanical Life: 10万次; Operating Temperature: -30℃~+85℃
U2 = CP2104-F03-GM: Applications Function:USB转UART Protocol:UART Supply Voltage:3V~3.6V；1.8V Supply Voltage:3V~3.6V；1.8V Operating Temperature:-40℃~+85℃ Operating Temperature:-40℃~+85℃; LCSC Part Name: Silicon Labs-MCU 停产; Supplier Part: C430013; Manufacturer: SKYWORKS/SILICON LABS(芯科); Supplier Footprint: QFN-24-EP(4x4); JLCPCB Part Class: Extended Part; Datasheet: https://atta.szlcsc.com/upload/public/pdf/source/20190920/C430013_02F7DD4CA172B9E734C1F35D4DFFA16F.pdf; Supplier: LCSC; Applications Function: USB转UART; Protocol: UART; Supply Voltage: 3V~3.6V；1.8V; Operating Temperature: -40℃~+85℃
U71 = INA237AIDGSR: Supplier Part: C2864837; Manufacturer: TI(德州仪器); Supplier Footprint: VSSOP-10-0.5mm; JLCPCB Part Class: Extended Part; Datasheet: https://www.ti.com/cn/lit/gpn/ina237; Supplier: LCSC
U80 = TMP125AIDBVR: Supply Voltage:2.7V~5.5V Supply Voltage:2.7V~5.5V; Supplier Part: C105257; Manufacturer: TI(德州仪器); Supplier Footprint: SOT-23-6; JLCPCB Part Class: Extended Part; Datasheet: https://www.ti.com/cn/lit/gpn/tmp125; Supplier: LCSC; Supply Voltage: 2.7V~5.5V
U131 = SR251260F0M50MZ: Type:Current Sensing Resistors Resistance:0.5mΩ Tolerance:±1% Tolerance:±1% Rated Output Voltage:- Power(Watts): Rated Current:- Temperature Coefficient:- Temperature Coefficient:- Mounting Sytle:; LCSC Part Name: 0.5mΩ ±1% 6W; Supplier Part: C5119469; Manufacturer: EVER OHMS(天二科技); Supplier Footprint: 2512; JLCPCB Part Class: Extended Part; Datasheet: https://atta.szlcsc.com/upload/public/pdf/source/20220817/95D0FD8B18FBA4551A41B900E07B2D8F.pdf; Supplier: LCSC; Type: Current Sensing Resistors; Tolerance: ±1%
C165 C166 = GRM158R61A226ME15D: Capacitance: Tolerance:±20% Tolerance:±20% Voltage Rated: Temperature Coefficient:; LCSC Part Name: 22uF ±20% 10V; Supplier Part: C3845593; Manufacturer: muRata(村田); Supplier Footprint: 0402; JLCPCB Part Class: Extended Part; Datasheet: https://atta.szlcsc.com/upload/public/pdf/source/20230811/016E9304DA64D47AB1EFBD6C89B0D146.pdf; Supplier: LCSC; Tolerance: ±20%
C168 C170 = CA45A-A-10V-22uF-K: Capacitance: Tolerance:±10% Tolerance:±10% Rated Voltage: Equivalent Series Resistance(ESR):6Ω@100kHz Operating Temperature:-55℃~+125℃ Operating Temperature:-55℃~+125℃; LCSC Part Name: 22uF ±10% 10V; Supplier Part: C141745; Manufacturer: CEC(振华新云); Supplier Footprint: CASE-A-3216; JLCPCB Part Class: Extended Part; Datasheet: https://atta.szlcsc.com/upload/public/pdf/source/20171123/C141745_15114109667701137621.pdf; Supplier: LCSC; Tolerance: ±10%; Equivalent Series Resistance(ESR): 6Ω@100kHz; Operating Temperature: -55℃~+125℃
C171 C172 = T491A106K020AT: Capacitance: Tolerance:±10% Tolerance:±10% Rated Voltage: Leakage Current(DCL):- Ripple Current:- Equivalent Series Resistance(ESR):5Ω Operating Temperature:-55℃~+125℃ Operating Temperature:-55℃~+125℃; LCSC Part Name: 10uF ±10% 20V; Supplier Part: C1953442; Manufacturer: KEMET(基美); Supplier Footprint: 1206; JLCPCB Part Class: Extended Part; Datasheet: https://atta.szlcsc.com/upload/public/pdf/source/20210416/95C0EC5B3581C9A90529545117ABEAC1.pdf; Supplier: LCSC; Tolerance: ±10%; Equivalent Series Resistance(ESR): 5Ω; Operating Temperature: -55℃~+125℃
C173 = CL31B225KCHSNNE: Capacitance: Tolerance:±10% Tolerance:±10% Voltage Rated: Temperature Coefficient:; LCSC Part Name: 2.2uF ±10% 100V; Supplier Part: C170101; Manufacturer: SAMSUNG(三星); Supplier Footprint: 1206; JLCPCB Part Class: Extended Part; Datasheet: https://atta.szlcsc.com/upload/public/pdf/source/20160218/1457707763339.pdf; Supplier: LCSC; Tolerance: ±10%
C174 = AC0805KKX7R0BB104: Capacitance: Tolerance:±10% Tolerance:±10% Voltage Rated: Temperature Coefficient:; LCSC Part Name: 100nF ±10% 100V; Supplier Part: C723382; Manufacturer: YAGEO(国巨); Supplier Footprint: 0805; JLCPCB Part Class: Extended Part; Datasheet: https://atta.szlcsc.com/upload/public/pdf/source/20200817/C723382_AC448A9AD2A55B1C02DDD82739EFE8BD.pdf; Supplier: LCSC; Tolerance: ±10%
C175 = CL05A106MP5NUNC_C315248: Capacitance: Tolerance:±20% Tolerance:±20% Voltage Rated: Temperature Coefficient:; LCSC Part Name: 10uF ±20% 10V; Supplier Part: C315248; Manufacturer: SAMSUNG(三星); Manufacturer Part: CL05A106MP5NUNC; Supplier Footprint: 0402; JLCPCB Part Class: Extended Part; Datasheet: https://atta.szlcsc.com/upload/public/pdf/source/20231220/1EF805BAE1520675928CC4638D279E74.pdf; Supplier: LCSC; Tolerance: ±20%
C176 C177 = TCC0402X5R105M100AT: Capacitance:1uF Tolerance:±20% Tolerance:±20% Voltage Rated: Temperature Coefficient:; LCSC Part Name: 1uF ±20% 10V; Supplier Part: C2887020; Manufacturer: CCTC(三环); Supplier Footprint: 0402; JLCPCB Part Class: Extended Part; Datasheet: https://atta.szlcsc.com/upload/public/pdf/source/20191203/C466239_F62A586702D44EEA1C39B32FC8662B21.pdf; Supplier: LCSC; Tolerance: ±20%
D19 = SS34_C8678: Diode Configuration:Single Forward Voltage (Vf@If):550mV@3A Reverse Voltage (Vr):40V Rectified Current:3A Reverse Leakage Current (Ir):500uA@40V; LCSC Part Name: 电压:40V 电流:3A; Supplier Part: C8678; Manufacturer: MDD(辰达半导体); Supplier Footprint: SMA(DO-214AC); JLCPCB Part Class: Basic Part; Datasheet: https://atta.szlcsc.com/upload/public/pdf/source/20230314/A80AE34493C69B89E2F4B1712F433538.pdf; Supplier: LCSC; Diode Configuration: Single; Forward Voltage (Vf@If): 550mV@3A; Reverse Voltage (Vr): 40V; Rectified Current: 3A; Reverse Leakage Current (Ir): 500uA@40V
L7 = SMMS0420-4R7M: Inductance: Tolerance:±20% Tolerance:±20% Rated Current: Saturation Current (Isat):3A DC Resistance (DCR): Type:一体成型电感; LCSC Part Name: 4.7uH ±20% 3A; Supplier Part: C133193; Manufacturer: SXN(顺翔诺); Supplier Footprint: SMD; JLCPCB Part Class: Extended Part; Datasheet: https://atta.szlcsc.com/upload/public/pdf/source/20210810/BBF24330FB2F5029F637830BA9C42C0D.pdf; Supplier: LCSC; Tolerance: ±20%; Saturation Current (Isat): 3A; Type: 一体成型电感
L9 = PSPNAQ3015-3R3M: Inductance: Tolerance:±20% Tolerance:±20% Rated Current:1.52A Saturation Current (Isat):1.62A DC Resistance (DCR):72mΩ Ratings:AEC-Q200; LCSC Part Name: 3.3uH ±20% 1.62A; Supplier Part: C436634; Manufacturer: PROD(谱罗德); Supplier Footprint: 1212; JLCPCB Part Class: Extended Part; Datasheet: https://atta.szlcsc.com/upload/public/pdf/source/20221209/4F4F25EB9B3360B8E09DF2B7816A7ADC.pdf; Supplier: LCSC; Tolerance: ±20%; Rated Current: 1.52A; Saturation Current (Isat): 1.62A; DC Resistance (DCR): 72mΩ; Ratings: AEC-Q200
Q14 Q18 Q19 = PCJ3139K: Supplier Part: C2912539; Manufacturer: TECH PUBLIC(台舟); Supplier Footprint: SOT-723; JLCPCB Part Class: Extended Part; Datasheet: https://atta.szlcsc.com/upload/public/pdf/source/20211102/9CFD33935E98A8C199E2D39F59AC9533.pdf; Supplier: LCSC
R127-R129 = CR-02FL6--100K: Type:Thick Film Resistors Resistance: Tolerance:±1% Tolerance:±1% Power(Watts): Overload Voltage (Max): Operating Temperature Range:-55℃~+155℃ Operating Temperature Range:-55℃~+155℃; LCSC Part Name: 厚膜电阻 100kΩ ±1% 62.5mW; Supplier Part: C279979; Manufacturer: Viking(光颉); Supplier Footprint: 0402; JLCPCB Part Class: Extended Part; Datasheet: https://atta.szlcsc.com/upload/public/pdf/source/20191209/C468528_6D47111E78448DF1E24F001397B2DC7E.pdf; Supplier: LCSC; Type: Thick Film Resistors; Tolerance: ±1%; Operating Temperature Range: -55℃~+155℃
R134 = WR04X1103FTL: Type:Thick Film Resistors Resistance: Tolerance:±1% Tolerance:±1% Power(Watts): Overload Voltage (Max): Temperature Coefficient:±100ppm/℃ Temperature Coefficient:±100ppm/℃ Operating Temperature Range:-55℃~+155℃ Operating Temperature Range:-55℃~+155℃; LCSC Part Name: 厚膜电阻 110kΩ ±1% 62.5mW; Supplier Part: C168195; Manufacturer: Walsin(华新科); Supplier Footprint: 0402; JLCPCB Part Class: Extended Part; Datasheet: https://atta.szlcsc.com/upload/public/pdf/source/20191217/C470037_D99261402F77DA8B1D609223749D445A.pdf; Supplier: LCSC; Type: Thick Film Resistors; Tolerance: ±1%; Temperature Coefficient: ±100ppm/℃; Operating Temperature Range: -55℃~+155℃
R135 = AECR0402F15K0K9: Type:Thick Film Resistors Resistance: Tolerance:±1% Tolerance:±1% Power(Watts): Overload Voltage (Max): Temperature Coefficient:±100ppm/℃ Temperature Coefficient:±100ppm/℃ Operating Temperature Range:-55℃~+155℃ Operating Temperature Range:-55℃~+155℃; LCSC Part Name: 厚膜电阻 15kΩ ±1% 63mW; Supplier Part: C328303; Manufacturer: RESI(开步睿思); Supplier Footprint: 0402; JLCPCB Part Class: Extended Part; Datasheet: https://atta.szlcsc.com/upload/public/pdf/source/20181212/C352486_55819DC58ECB15BFA3B0F11121E3606D.pdf; Supplier: LCSC; Type: Thick Film Resistors; Tolerance: ±1%; Temperature Coefficient: ±100ppm/℃; Operating Temperature Range: -55℃~+155℃
R136 = 0402WGJ0513TCE: Type:Thick Film Resistors Resistance:51kΩ Tolerance:±5% Tolerance:±5% Power(Watts): Overload Voltage (Max): Temperature Coefficient:±100ppm/℃ Temperature Coefficient:±100ppm/℃ Operating Temperature Range:-55℃~+155℃ Operating Temperature Range:-55℃~+155℃; LCSC Part Name: 51kΩ ±5% 62.5mW 厚膜电阻; Supplier Part: C25565; Manufacturer: UNI-ROYAL(厚声); Supplier Footprint: 0402; JLCPCB Part Class: Extended Part; Datasheet: https://atta.szlcsc.com/upload/public/pdf/source/20200306/C422600_1E6D84923E4A46A82E41ADD87F860B5C.pdf; Supplier: LCSC; Type: Thick Film Resistors; Tolerance: ±5%; Temperature Coefficient: ±100ppm/℃; Operating Temperature Range: -55℃~+155℃
U72 = LMR50410Y3FQDBVRQ1: Function:Step-down type Output Type:Fixed Input Voltage:4V~36V Input Voltage:4V~36V Output Voltage:3.3V Output Voltage:3.3V Output Current (Max):1A Switching Frequency:2.1MHz Operating Temperature:-40℃~+150℃@(TJ) Operating Temperature:-40℃~+150℃@(TJ) Sync; Supplier Part: C5219374; Manufacturer: TI(德州仪器); Supplier Footprint: SOT-23-6; JLCPCB Part Class: Extended Part; Datasheet: https://www.ti.com/cn/lit/gpn/lmr50410-q1; Supplier: LCSC; Function: Step-down type; Output Type: Fixed; Input Voltage: 4V~36V; Output Voltage: 3.3V; Output Current (Max): 1A; Switching Frequency: 2.1MHz; Operating Temperature: -40℃~+150℃@(TJ); Synchronous Rectification: Yes; Number of Outputs: 1; Topology: Step-down; Quiescent Current (Iq): 80uA; Switch tube (built-in/external): 内置
U76 U129 = AMS1117-3.3_C2904742: Output Type: Maximum Input Voltage:20V Output Voltage:3.3V Output Voltage:3.3V MAX Output Current:1A Power Supply Rejection Ratio (PSRR):75dB@(120Hz) Dropout Voltage:1.25V@(1A) standby current:5mA Noise:0.003%Vout Operating Temperature:±125℃@(Tj) Operatin; Supplier: LCSC; Supplier Part: C2904742; Manufacturer: YONGYUTAI(永裕泰); JLCPCB Part Class: Extended Part; LCSC Part Name: 输入20V 输出3.3V 1A; Supplier Footprint: SOT-89-3; Datasheet: https://atta.szlcsc.com/upload/public/pdf/source/20211011/2BB92D449F9C5B64FAC2088525330307.pdf; Maximum Input Voltage: 20V; Output Voltage: 3.3V; MAX Output Current: 1A; Power Supply Rejection Ratio (PSRR): 75dB@(120Hz); Dropout Voltage: 1.25V@(1A); standby current: 5mA; Noise: 0.003%Vout; Operating Temperature: ±125℃@(Tj); Output Polarity: Positive electrode; Number of Outputs: 1
U86 U90 U94-U96 = 74LVC1G14GW,125_C265125: Input Type:Schmitt Trigger Supply Voltage(Single):1.65V~5.5V Supply Voltage(Single):1.65V~5.5V Supply Current (Max):4uA Number of Circuits:1 Number of Inputs:1 Sink Current:32mA Source Current:32mA High level range (VIH):1.14V~2.79V High level range (VIH); Supplier Part: C265125; Manufacturer: Nexperia(安世); Supplier Footprint: TSSOP-5; JLCPCB Part Class: Extended Part; Datasheet: https://atta.szlcsc.com/upload/public/pdf/source/20240724/1F43494E660D060109F6015F066F9E80.pdf; Supplier: LCSC; Input Type: Schmitt Trigger; Supply Voltage(Single): 1.65V~5.5V; Supply Current (Max): 4uA; Number of Circuits: 1; Number of Inputs: 1; Sink Current: 32mA; Source Current: 32mA; High level range (VIH): 1.14V~2.79V; Low level range (VIL): 460mV~1.58V; Max Propagation Delay: 6.5ns@5V,50pF; Series: 74LVCSeries; Operating Temperature: -40℃~+125℃
U91-U93 = SN74AHC1G08DBVR: Logic Gate Type:与门 Number of Channels:1 Supply Voltage:2V~5.5V Supply Voltage:2V~5.5V Quiescent Current (Max):1uA Sink Current:8mA Source Current:8mA High Level Range (VIH):1.5V~3.85V High Level Range (VIH):1.5V~3.85V Low Level Range (VIL):500mV~1.65V Low; Supplier Part: C7467; Manufacturer: TI(德州仪器); Supplier Footprint: SOT-23-5; JLCPCB Part Class: Extended Part; Datasheet: https://www.ti.com/cn/lit/gpn/sn74ahc1g08; Supplier: LCSC; Logic Gate Type: 与门; Number of Channels: 1; Supply Voltage: 2V~5.5V; Quiescent Current (Max): 1uA; Sink Current: 8mA; Source Current: 8mA; High Level Range (VIH): 1.5V~3.85V; Low Level Range (VIL): 500mV~1.65V; Series: 74AHCSeries; Propagation Delay Time: 7.9ns@5V,50pF; Operating Temperature: -55℃~+125℃
U128 = MT3608L: Supplier Part: C2932326; Manufacturer: 西安航天民芯; Supplier Footprint: SOT-23-6; JLCPCB Part Class: Extended Part; Datasheet: https://atta.szlcsc.com/upload/public/pdf/source/20211213/953A62CC1033762E00AABAD4906DD7F1.pdf; Supplier: LCSC
U130 = NCP167BMX330TBG: Output Type:-; LCSC Part Name: NCP167BMX330TBG LDO 稳压器，700 mA， 超低 Iq，超高 PSRR，超低噪音; Supplier Part: C892227; Manufacturer: onsemi(安森美); Supplier Footprint: XDFN-4-EP(1x1); JLCPCB Part Class: Extended Part; Datasheet: https://atta.szlcsc.com/upload/public/pdf/source/20210624/C892227_4E8EE9E6AF4A17859F0DD9B28B6DAE65.pdf; Supplier: LCSC

## Nets
+3V3: BUZZER1.1(+) C1.2 C6.2 C14.1 C18.2 C19.2 C20.2 C22.2 C23.2 C24.2 C28.2 C29.2 C32.2 C165.2 C178.2 CN1.2 CN2.2 D2.1 D4.1(C) L2.1 L7.1 Q14.3(D) Q18.3(D) Q19.3(D) R2.2 R109.2 R121.2 R122.2 R124.2 R125.2 U1.1(VDDA) U1.19(VDD3P3_RTC) U1.26(VDD_SDIO) U1.37(VDD3P3_CPU) U1.43(VDDA) U1.46(VDDA) U2.5(VIO) U2.6(VDD) U2.7(REGIN) U71.6(VS) U71.8(VBUS) U78.8(VDD) U80.3(V+) U82.7(3V3) U128.4(EN) U128.5(VIN) U131.2
+5V: C166.2 D19.1(K) R134.2 U82.10(5V)
GND: C1.1 C6.1 C11.2 C13.2 C14.2 C17.1 C18.1 C19.1 C20.1 C22.1 C23.1 C24.1 C27.1 C28.1 C29.1 C30.2 C31.2 C32.1 C165.1 C166.1 C168.2 C170.2 C171.2 C172.2 C173.1 C175.1 C176.1 C177.1 C178.1 C181.1 C182.1 CN1.1 CN1.5 CN1.6 CN2.1 CN2.5 CN2.6 CN3.2 CN3.3 CN3.4 D2.2 L4.1 LED1.3(A) LED1.4(A) Q15.2(E) R102.2 R103.2 R108.1 R110.2 R123.1 R126.2 R135.1 R137.1 SW1.3(C) SW1.4(D) SW4.3(C) SW4.4(D) U1.49(GND) U2.2(GND) U2.16(VPP) U2.25(EP) U9.2 U71.1(A1) U71.2(A0) U71.7(GND) U72.2(GND) U76.1(GND) U77.2(GROUND) U78.4(VSS) U80.1(GND) U81.1 U82.8(GND1) U82.9(GND2) U84.2 U86.3(GND) U90.3(GND) U91.3(GND) U92.3(GND) U93.3(GND) U94.3(GND) U95.3(GND) U96.3(GND) U128.2(GND) U129.1(GND) U130.2(GND) U130.5(EPAD) U131.1 USB2.A1(GND) USB2.A12(GND) USB2.B1(GND) USB2.B12(GND) USB2.S1 X2.1 X2.3
VBUS: C171.1 D5.1(C) R107.2 U129.3(INPUT)
VBUS_3V3: C170.1 D6.2(A) Q14.2(S) R127.2 U86.2(A) U94.2(A) U129.2(OUTPUT)
VCC_BT: C172.1 CN3.1 U76.3(INPUT)
VCC_HT: C173.2 U72.4(EN) U72.5(VIN) U84.1
ALWAYS_ON_IN: C176.2 D6.1(C) D20.1(C) D21.1(C) U130.3(EN) U130.4(IN)
ALWAYS_ON_OUT: C177.2 U86.5(VCC) U90.5(VCC) U91.5(VCC) U92.5(VCC) U93.5(VCC) U94.5(VCC) U95.5(VCC) U96.5(VCC) U130.1(OUT)
ANALOG: U1.10(IO34) U82.1(AN)
BT_3V3: C168.1 D20.2(A) Q18.2(S) R128.2 U76.2(OUTPUT) U90.2(A) U91.2(B)
BUZZER: R104.1 U1.14(IO25)
CTN: C181.2 R138.1 U1.8(SENSOR_VN)
CTS: R114.1 U2.18(CTS)
DTR: Q17.2(E) R105.1 U2.23(DTR)
EN: Q16.3(C) R115.1 U1.9(EN) U82.2(RST)
GATE_BT: U91.4(Y) U96.2(A)
GATE_BT_INV: Q18.1(G) R128.1 U96.4(Y)
GATE_HT: U93.4(Y) U95.2(A)
GATE_HT_INV: Q19.1(G) R129.1 U95.4(Y)
GPIO0: Q17.3(C) R116.1 U1.23(IO0)
GPIO13: R113.2 U1.20(IO13)
GPIO15: R114.2 U1.21(IO15)
GREEN: R119.2 U1.15(IO26)
HT_3V3: C175.2 D21.2(A) L9.2 Q19.2(S) R129.2 R136.2 U93.2(B)
I2C_SCL: CN1.4 CN2.4 R122.1 U1.39(IO22) U71.5(SCL) U82.12(SCL)
I2C_SDA: CN1.3 CN2.3 R121.1 U1.42(IO21) U71.4(SDA) U82.11(SDA)
IN+: C33.2 R125.1 U71.10(IN+)
IN-: C33.1 R126.1 U71.9(IN–)
INA_ALERT: U1.13(IO33) U71.3(ALERT)
INT: U1.24(IO4) U82.15(INT)
PWM: U1.12(IO32) U82.16(PWM)
RED: R120.2 U1.16(IO27)
RTS: Q16.2(E) R106.1 R113.1 U2.19(RTS)
SD_CLK: U1.31(CLK) U78.6(SCLK)
SD_DATA_0: U1.32(SD0) U78.5(SI/SIO0)
SD_DATA_1: U1.33(SD1) U78.2(SO/SIO1)
SD_DATA_2: U1.28(SD2) U78.3(SIO2)
SD_DATA_3: U1.29(SD3) U78.7(SIO3)
SPI_CLK: U1.35(IO18) U80.4(SCK) U82.4(SCK)
SPI_CS: U1.34(IO5) U80.5(CS#) U82.3(CS)
SPI_SDI: U1.38(IO19) U80.2(SI) U82.5(MISO)
SPI_SDO: U1.36(IO23) U80.6(SO) U82.6(MOSI)
SRAM_CS: U1.25(IO16) U78.1(#CE)
U0RXD: R111.1 U1.40(U0RXD) U82.14(RX)
U0TXD: R112.1 U1.41(U0TXD) U82.13(TX)
UART_RX: R112.2 U2.20(RXD)
UART_TX: R111.2 U2.21(TXD)
USB+: U2.3(D+) U9.6
USB-: U2.4(D-) U9.4
USB_ESD+: U9.1 USB2.A6(Dp1) USB2.B6(Dp2)
USB_ESD-: U9.3 USB2.A7(Dn1) USB2.B7(Dn2)
USB_GATE_INV: Q14.1(G) R127.1 U94.4(Y)
$1N3149: U86.4(Y) U91.1(A) U92.1(A)
$1N3363: U90.4(Y) U92.2(B)
$1N3445: U92.4(Y) U93.1(A)
$1N8585: D19.2(A) L7.2 U128.1(SW)
$1N8591: R134.1 R135.2 U128.3(FB)
$1N14453: C174.2 U72.1(CB)
$1N14493: C174.1 L9.1 U72.6(SW)
$1N14659: R136.1 R137.2 U72.3(FB)
$2N4651: R101.2 U1.2(LNA_IN)
$2N4659: C17.2 L2.2 U1.3(VDDA3P3) U1.4(VDDA3P3)
$2N4669: R2.1 U1.18(IO12)
$2N5562: C12.2 U1.47(CAP2_NC) U6.2
$2N5759: U1.45(XTAL_P_NC) U4.1
$2N5845: C11.1 C12.1 U1.48(CAP1_NC) U6.1
$2N5921: C13.1 U4.2 X2.2(GND)
$2N5944: C21.1 U1.44(XTAL_N_NC) X2.4(GND)
$2N10074: C25.2 R101.1
$2N10076: C25.1 C26.2 U81.2
$2N10117: C26.1 L4.2 U77.3(FEED_BLUETOOTH)
$3N4762: BUZZER1.2 D4.2(A) Q15.3(C)
$3N5003: Q15.1(B) R104.2
$3N5332: Q17.1(B) R106.2
$3N5334: Q16.1(B) R105.2
$3N6540: R107.1 R108.2 U2.8(VBUS)
$3N6650: R109.1 U2.9(RST#)
$3N6731: R110.1 U2.15(SUSPEND#)
$3N7291: C30.1 R115.2 SW1.1(A) SW1.2(B)
$3N7647: C31.1 R116.2 SW4.1(A) SW4.2(B)
$3N10620: LED1.1(K) R119.1
$3N10658: LED1.2(K) R120.1
$3N15296: C182.2 R123.2 R124.1 R138.2
$5N1088: R102.1 USB2.B5(CC2)
$5N1129: R103.1 USB2.A5(CC1)
$5N1175: L1.2 USB2.A4(VBUS) USB2.A9(VBUS) USB2.B4(VBUS) USB2.B9(VBUS)
$5N1423: C27.2 D5.2(A) L1.1 U9.5

Not connected (* = marked no-connect by the designer): C21 2; U1 5(SENSOR_VP)* 6(SENSOR_CAPP)* 7(SENSOR_CAPN)* 11(IO35)* 17(IO14)* 22(IO2)* 27(IO17)* 30(CMD)*; U2 1(RI)* 10(NC)* 11(GPIO.3)* 12(GPIO.2)* 13(GPIO.1)* 14(GPIO.0)* 17(SUSPEND)* 22(DSR)* 24(DCD)*; U77 1(MOUNTING PAD)* 4(FEED_GNSS)*; U86 1(NC)*; U90 1(NC)*; U94 1(NC)*; U95 1(NC)*; U96 1(NC)*; U128 6(OC)*; USB2 A8(SBU1)* B8(SBU2)*

## Notes on the sheets
sheet 1
- Power Priority Selection Circuit
- Power Line Activation Circuit
- Gate signal inverting circuit
- Attention :
- Diodes prevents from voltage passing on the other power lines when unconnected
- Mandatory when using Type-P MOSFETS
- Interface
- LOGIC
- Interface
- LOGIC
- Status
- ✓✓
- Status
- ✓✓
- Note:
- Note:
- Step-Up Converter (3.3V to 5V for Mikrobus)
- High Voltage DC/DC Converter
- Low Voltage & USB VBUS DC/DC Converter
- Interface
- PWR
- Interface
- PWR
- Interface
- PWR
- Status
- ✓✓
- Status
- ✓✓
- Ratings of passive components : At least double of the
  maximum accepted voltage
- Status
- ✓✓
- Note:
- Ratings of passive components : 50V to 100V (except Cout)
- Note:
- Note:
- Low Voltage & USB VBUS DC/DC Converter
- Input : 1.9V to 5.5V (suitable for keeping 3.3V IN and 3.3V OUT)
- Interface
- PWR
- Status
- ✓✓
- Note:
sheet 2
- Note: For SDI and SDO pins, the Input/Output direction is from the perspective of the device in reference.
  - If both sides have MOSI and MISO, connect MOSI to MOSI and MISO to MISO.
  - For client devices, connect SDI to MOSI and SDO to MISO. (Our case for this project)
  - For host devices, connect SDI to MISO and SDO to MOSI.
- Note : The pin 4 is labeled as FEED_GNSS and pin 3 is labeled as FEED_BLUETOOTH
- Strapping pins (DO NOT USE!):
  IO0
  IO2
  IO5
  IO12
  IO15
- Attention (INPUT ONLY PINS):
  IO34
  IO35
  IO36
  IO39
sheet 3
- Buzzer
- Temperature Sensor
- Auto Program Table
- Interface
- PWM
- Interface
- SPI
- Status
- ✓✓
- Status
- ✓✓
- Note:
- Note:
- BOOT0 & Reset Tactile Switches
- Auto Program Circuit
- Interface
- GPIO
- Interface
- GPIO
- Interface
- USB
- Status
- ✓✓
- Status
- ✓✓
- Status
- ✓✓
- Note:
- Note:
- Note:
- Current Sensor
- Board Temperature Sensor (Negative Temperature Coefficient)
- User LED
- Interface
- AN
- Interface
- GPIO
- Status
- ✓✓
- Status
- ✓✓
- Note:
- Note:
- Interface
- I2C
- Status
- ✓✓
- Note:  I2C ADDR: 0x40
sheet 5
- USB-C Connector
- MikroBus Connector
- Interface
- Interface
- USB
- MIKROBUS
- Status
- ✓✓
- Status
- ✓✓
- Note: 5.1k pull-downs required on CC lines
- Note:
- Groove Connectors
- Low Voltage Connector
- High Voltage Solder Pads
- Interface
- GROOVE
- Interface
- PWR
- Interface
- PWR
- Status
- ✓✓
- Status
- ✓✓
- Status
- ✓✓
- Note:
- Note:
- Note:
